# EAGLE board PDNode_Devboard_v0.0.1 (EAGLE 9.2.1), part 1 of 2
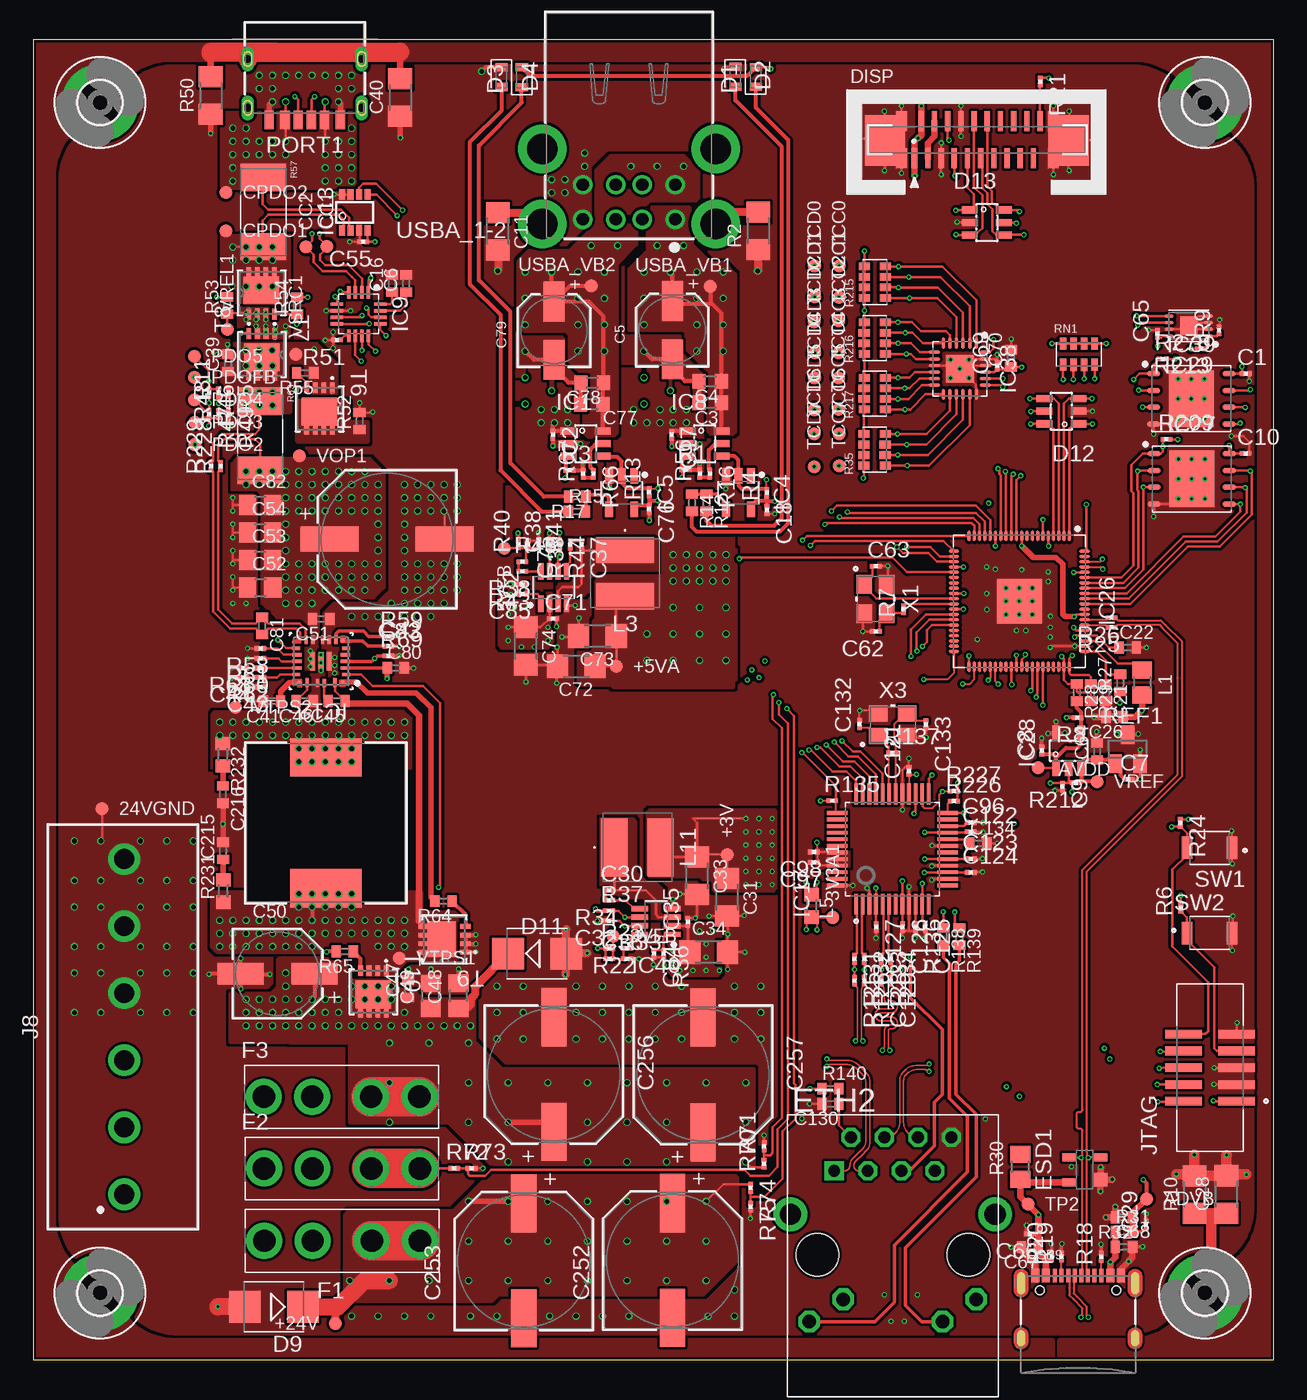
[diagram p7: board, top side]
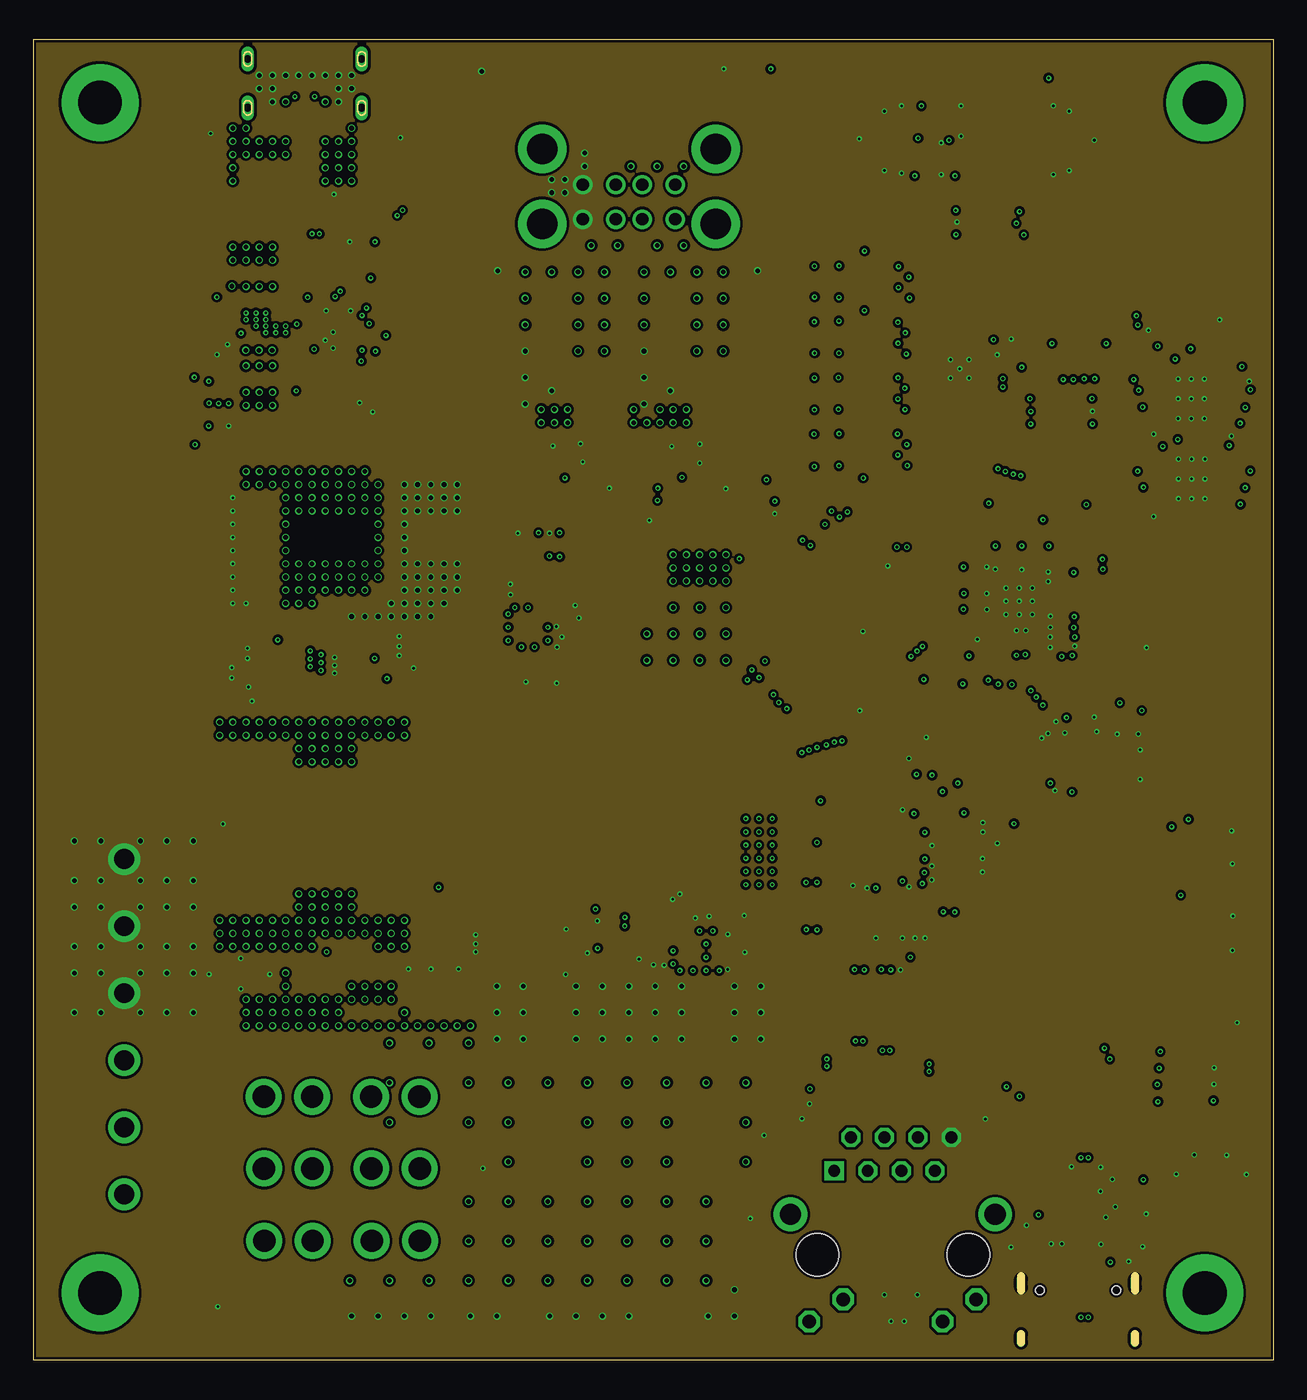
[diagram p8: board, inner layer L2-GND]
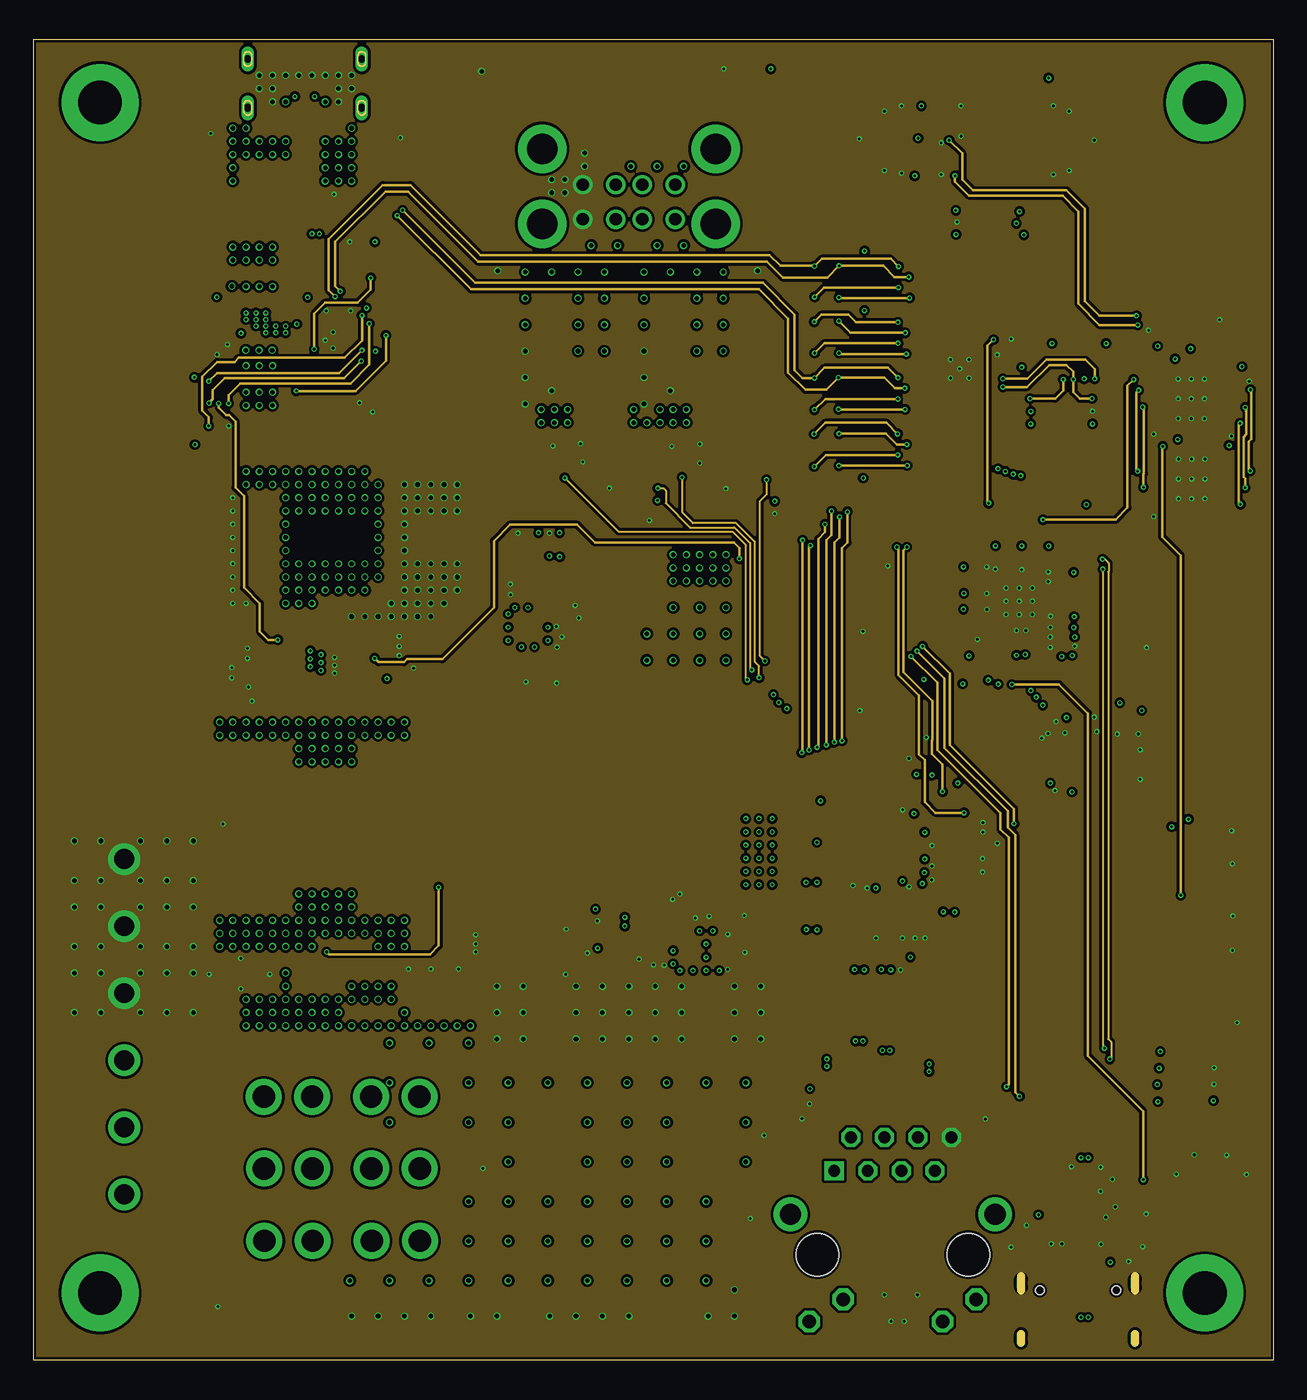
[diagram p9: board, inner layer L3-SIG]
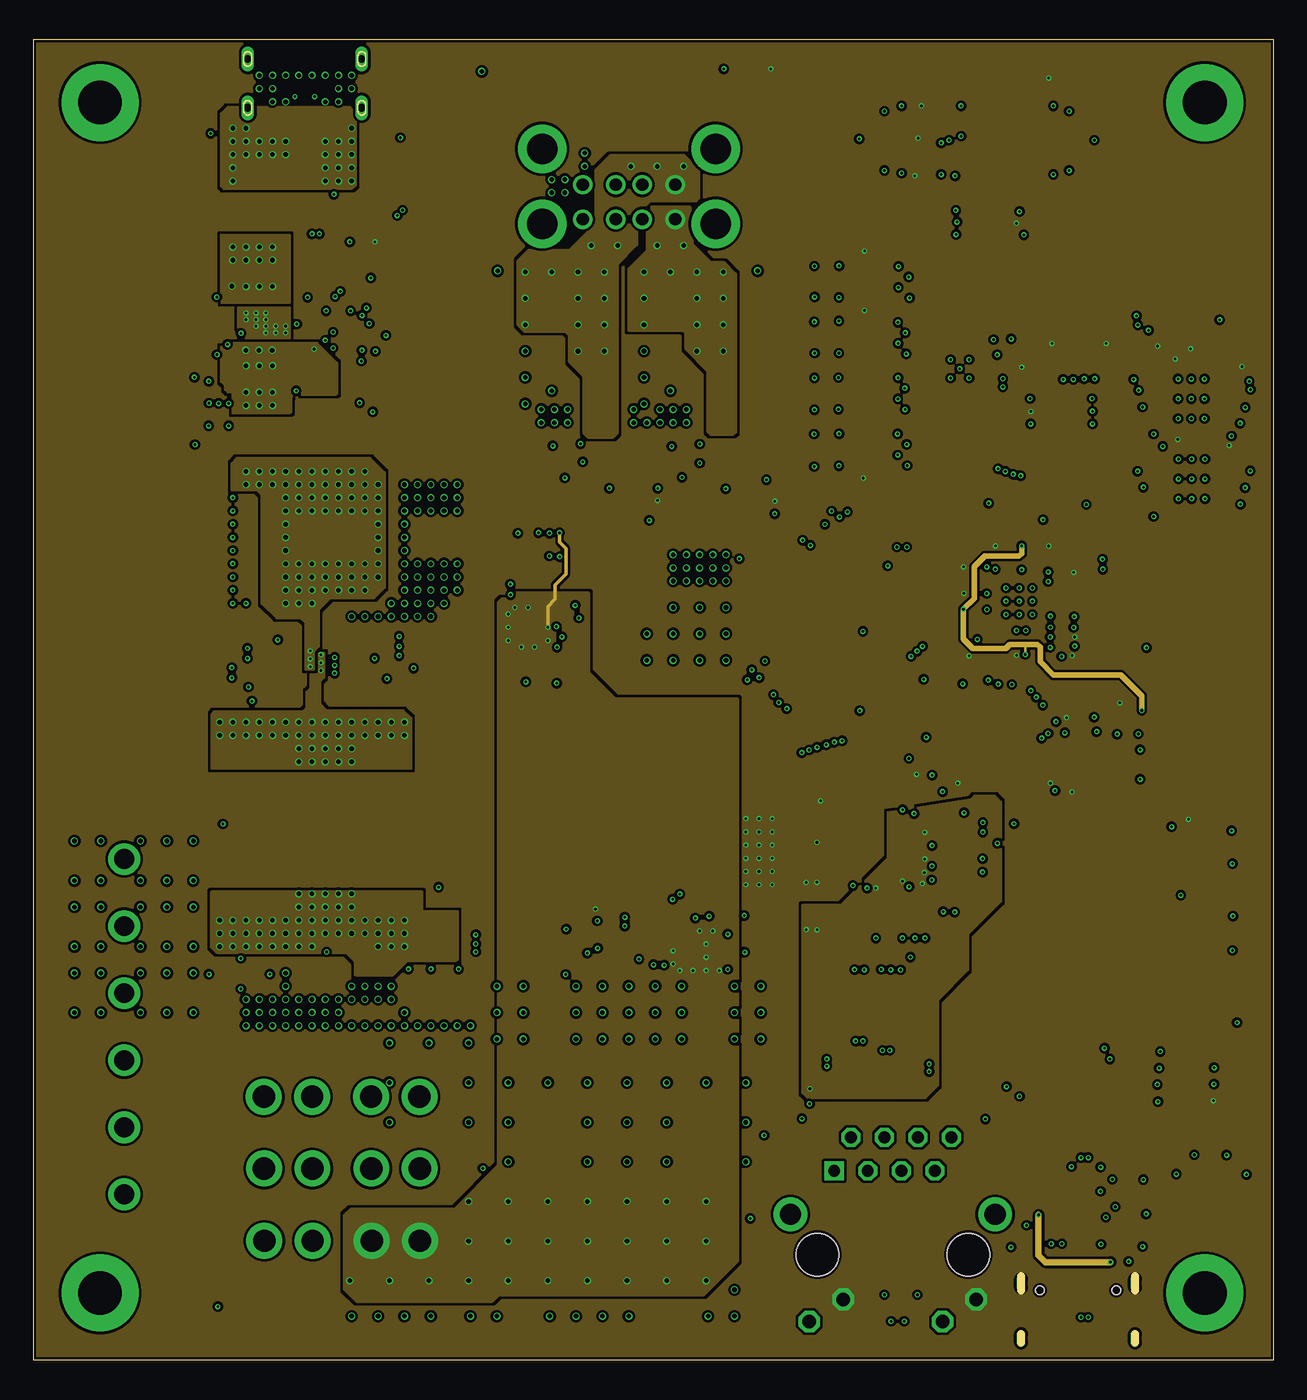
[diagram p10: board, inner layer L4-PWR]
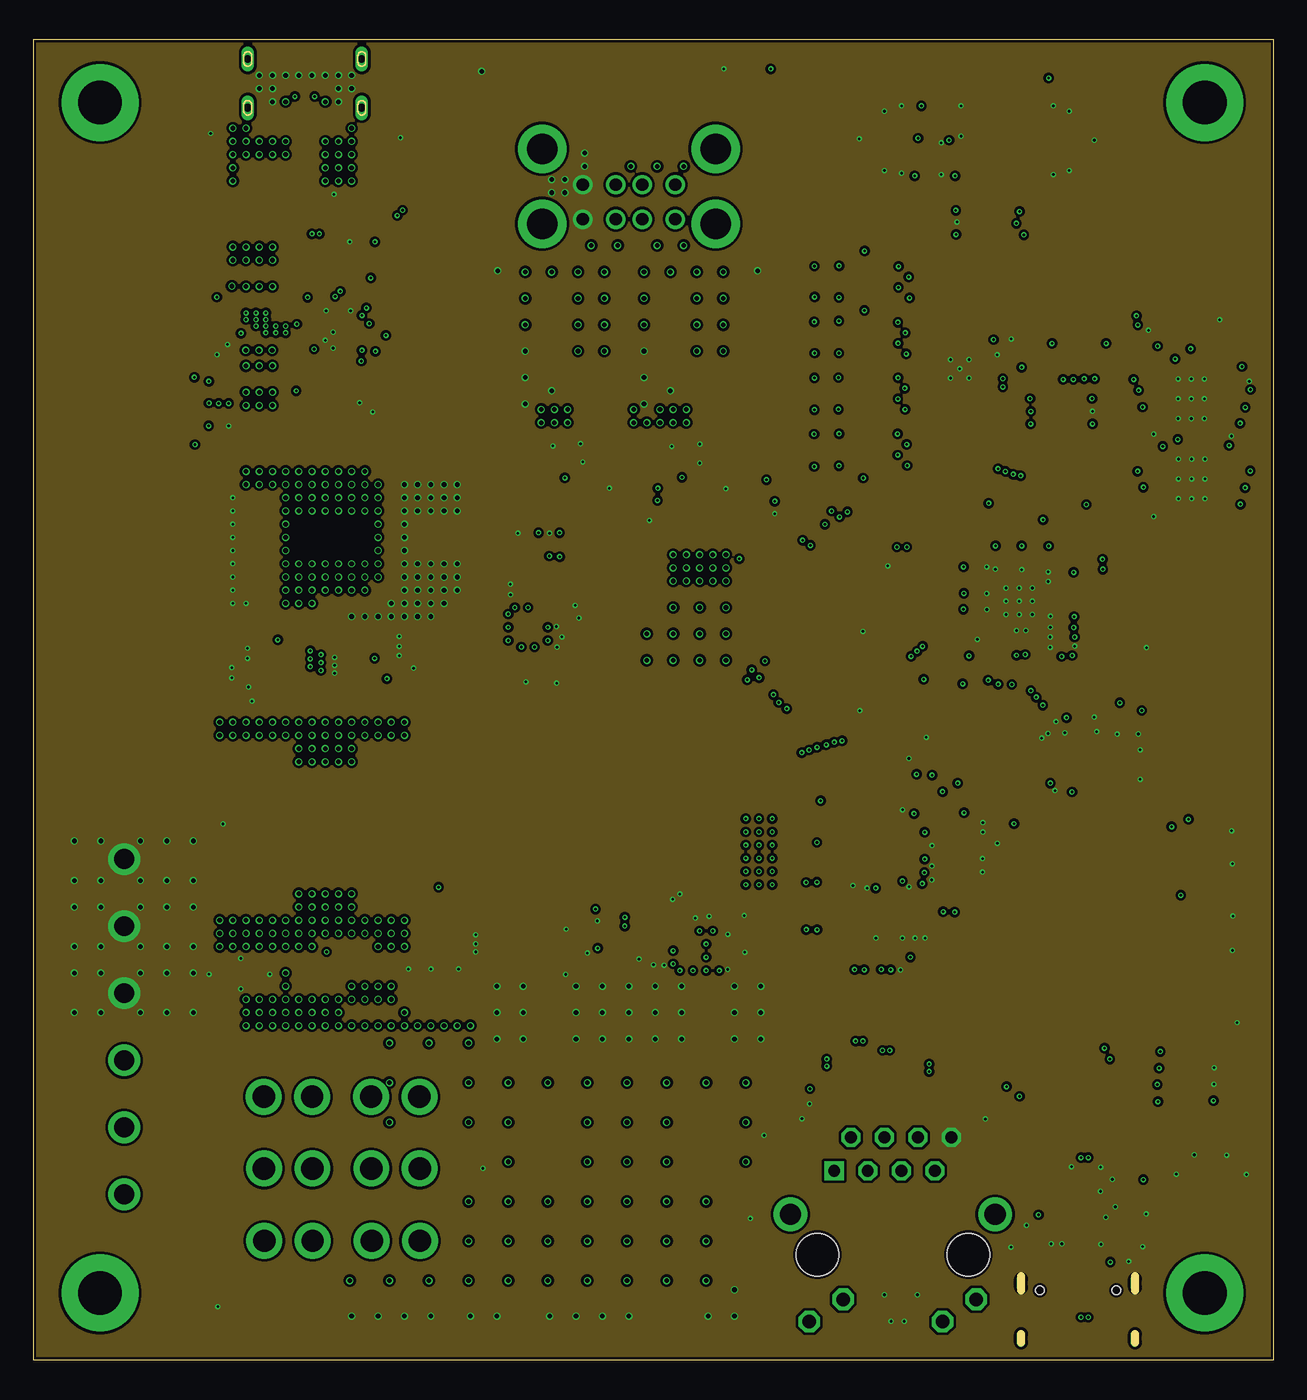
[diagram p11: board, inner layer L5-GND]
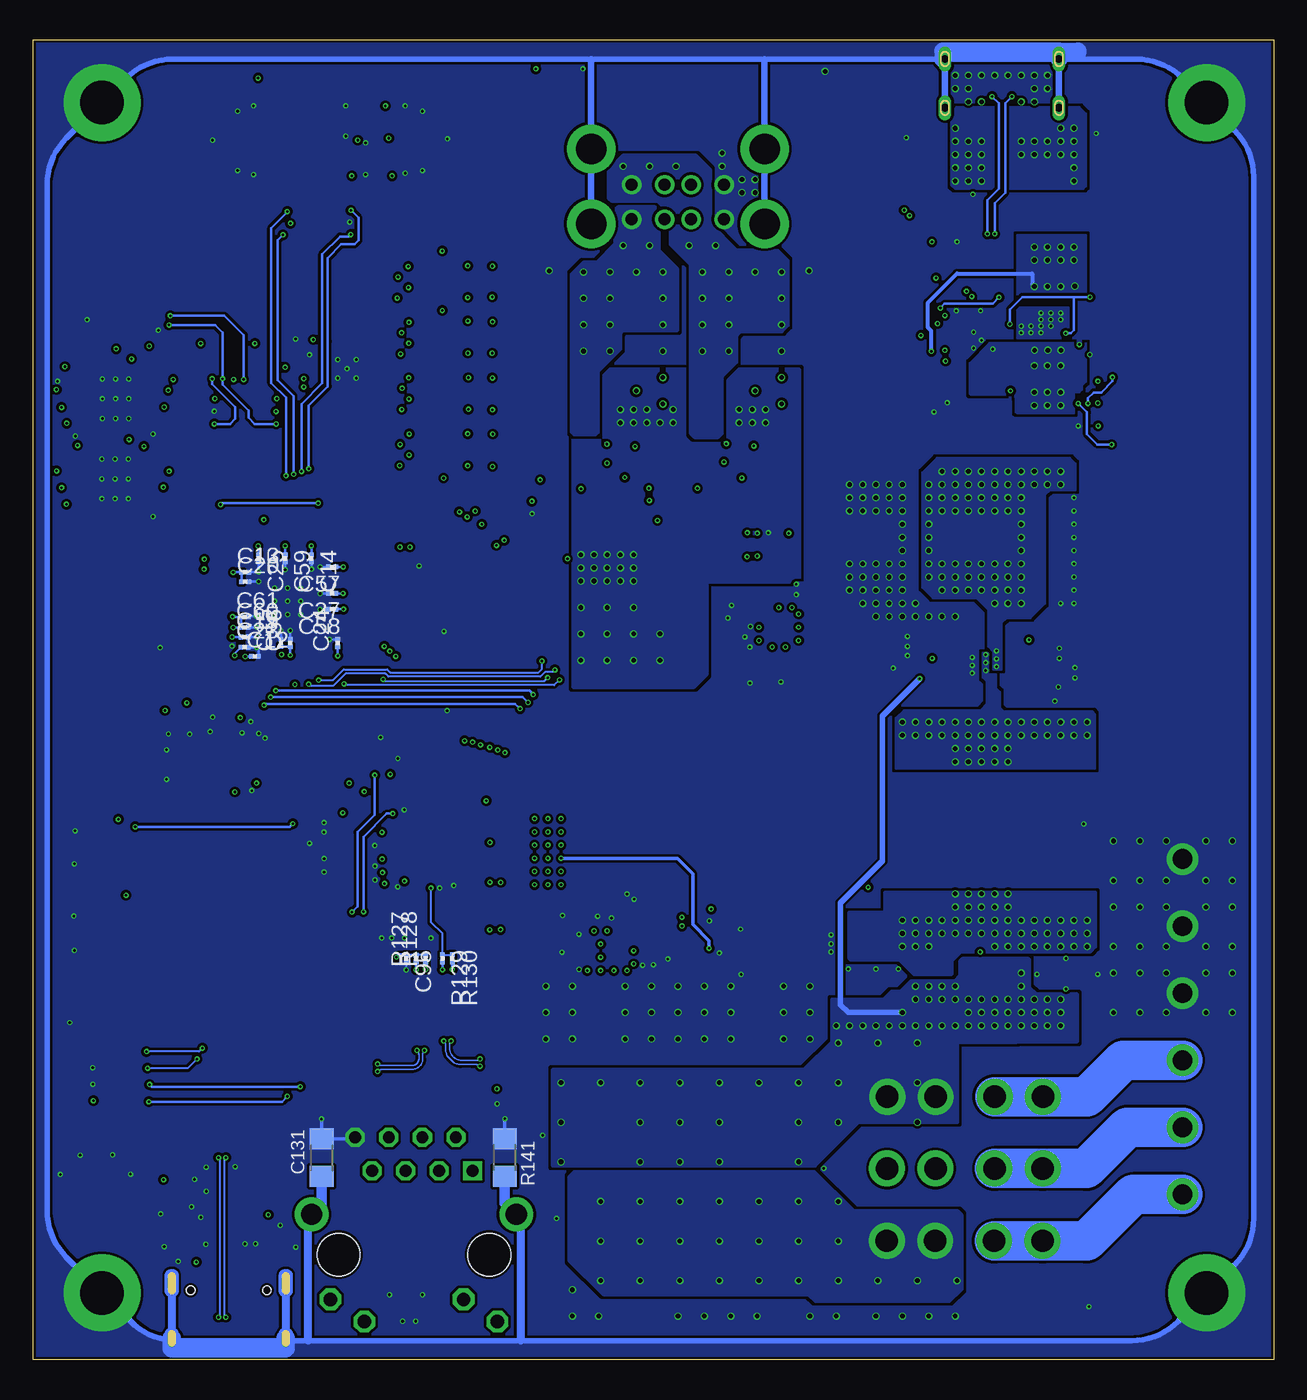
[diagram p12: board, bottom side, seen from below]

Size 94 x 100 mm. Coordinates in mm from the lower left corner, seen from the top.
Outline: 0,0 94,0 94,100 0,100 0,0
Copper layers (1+2*3+14*15+16): L1-HS 0.035mm / dielectric 0.0994mm / L2-GND 0.0152mm / dielectric 0.55mm / L3-SIG 0.0152mm / dielectric 0.1088mm / L4-PWR 0.0152mm / dielectric 0.55mm / L5-GND 0.0152mm / dielectric 0.0994mm / L6-HS 0.035mm
Design rules "JLC06161H-3313_6-layer_50RSE-85RD-90RD-100RD": minimum track width 3.5mil, minimum drill 0.15mm, track to track 3.5mil, track to pad 3.5mil, pad to pad 3.5mil, via to via 3.5mil, smd to smd 3.5mil, copper to edge 0.2mm, drill to drill 6mil, minimum pad ring 3.5mil, minimum via ring 3.5mil, stop-mask expansion 0.05mm, vias tented up to drill 16mil, thermal gap 10mil
Net classes: 0 50R_SE: width 0.149 mm, drill 0.2 mm, clearance 0.178 mm; 1 100R_DIFFPAIR: width 0.115 mm, drill 0.2 mm, clearance 0.178 mm; 2 90R_DIFFPAIR: width 0.149 mm, drill 0.2 mm, clearance 0.178 mm; 3 50R_DIFFPAIR: width 0.203 mm, drill 0.2 mm, clearance 0.178 mm

## Footprints (pad centres in the part's own frame; a part is rotated, then mirrored left to right if it is on the bottom)
TP-ROUND = smd 1 x 1: TP 0,0
0201 = smd 0.34 x 0.35: 1 -0.275,0; 2 0.275,0
0603 = smd 1 x 1.1: 1 -0.85,0; 2 0.85,0
5X5.5(DXL) = smd 3 x 1.6: 1 2.2,0; 2 -2.2,0
0402 = smd 0.7 x 0.9: 1 -0.65,0; 2 0.65,0
1206 = smd 1.6 x 1.803: 1 -1.422,0; 2 1.422,0
0805 = smd 1.3 x 1.5: 1 -0.95,0; 2 0.95,0
6.3X7.7(DXL) = smd 3.5 x 1.6: 1 2.8,0; 2 -2.8,0
10X10.5(DXL) = smd 4.4 x 1.9: 1 4.35,0; 2 -4.35,0
LED-0603 = smd 0.612 x 0.912: A 0.75,0; C -0.75,0
SMB = smd 2.4 x 2.4: A 2.2,0; C -2.2,0
SOT23-6 = smd 0.55 x 1.2: 1 -0.95,-1.3; 2 0,-1.3; 3 0.95,-1.3; 4 0.95,1.3; 5 0,1.3; 6 -0.95,1.3
FPC20 = smd 0.4 x 1.5: 1 -4.552,-1.362; 2 -4.052,1.438; 3 -3.552,-1.362; 4 -3.052,1.438; 5 -2.552,-1.362; 6 -2.052,1.438; 7 -1.552,-1.362; 8 -1.052,1.438; 9 -0.552,-1.362; 10 -0.052,1.438; 11 0.448,-1.362; 12 0.948,1.438; 13 1.448,-1.362; 14 1.948,1.438; 15 2.448,-1.362; 16 2.948,1.438; 17 3.448,-1.362; 18 3.948,1.438; 19 4.448,-1.362; 20 4.948,1.438 | smd 3.048 x 3.81: Z0 -6.795,0; Z5 7.112,0 | smd 0.8 x 1.5: Z1 -5.552,-1.362; Z2 -5.552,1.438; Z3 5.948,-1.362; Z4 5.948,1.438
SOT143 = smd 1 x 1: 1 -0.75,-1.2 | smd 0.6 x 1: 2 0.95,-1.2; 3 0.95,1.2; 4 -0.95,1.2
J1B1211CCD = drill 0.9 square: 1 -4.445,6.35 | drill 0.9 octagon: 2 -3.175,8.89; 3 -1.905,6.35; 4 -0.635,8.89; 5 0.635,6.35; 6 1.905,8.89; 7 3.175,6.35; 8 4.445,8.89 | drill 1.02 octagon: 9 -6.325,-5.08; 10 -3.758,-3.38; 11 3.758,-5.08; 12 6.325,-3.38 | drill 1.6: 13 -7.75,3.05; 14 7.75,3.05 | hole 3.25: -5.715,0; 5.715,0
FUSE_3544-2 = drill 1.7: 1_1 -5.895,0; 1_2 -2.235,0; 2_1 2.235,0; 2_2 5.895,0
3,3-PAD = drill 3.3 pad 5.842: B3,3 0,0
SOT65P280X110-8N = smd 1.259 x 0.4: 1 -1.228,0.975; 2 -1.228,0.325; 3 -1.228,-0.325; 4 -1.228,-0.975; 5 1.228,-0.975; 6 1.228,-0.325; 7 1.228,0.325; 8 1.228,0.975
SOT95P280X145-5N = smd 1.186 x 0.597: 1 -1.264,0.95; 2 -1.264,0; 3 -1.264,-0.95; 4 1.264,-0.95; 5 1.264,0.95
QFN50P300X300X55-16N = smd 0.937 x 0.264: 1 -1.641,0.75; 2 -1.641,0.25; 3 -1.641,-0.25; 4 -1.641,-0.75; 9 1.641,-0.75; 10 1.641,-0.25; 11 1.641,0.25; 12 1.641,0.75 | smd 0.264 x 0.937: 5 -0.75,-1.641; 6 -0.25,-1.641; 7 0.25,-1.641; 8 0.75,-1.641; 13 0.75,1.641; 14 0.25,1.641; 15 -0.25,1.641; 16 -0.75,1.641
RPM0026A-MFG = smd 0.306 x 0.306: 1 -1.661,1.555 | smd 0.6 x 0.25: 2 -1.9,1; 6 -1.9,-1; 14 1.9,-1; 18 1.9,1 | smd 0.725 x 0.25: 3 -1.837,0.5; 4 -1.837,0; 5 -1.837,-0.5; 15 1.837,-0.5; 16 1.837,0; 17 1.837,0.5 | smd 0.29 x 0.29: 7 -1.661,-1.554 | smd 0.25 x 0.625: 8 -1.125,-1.637; 9 -0.625,-1.637; 10 -0.125,-1.637; 11 0.625,-1.637; 12 1.125,-1.637 | smd 0.259 x 0.259: 13 1.644,-1.805 | smd 0.332 x 0.332: 19 1.641,1.591 | smd 0.25 x 0.675: 20 1.05,1.613; 23 -1.05,1.613 | smd 0.25 x 0.6: 21 0.25,1.65; 22 -0.25,1.65 | smd 0.375 x 1.425: 24 -0.625,0; 25 0,0; 26 0.625,0
SOT23-8 = smd 0.45 x 0.8: 1 -0.975,-1.35; 2 -0.325,-1.35; 3 0.325,-1.35; 4 0.975,-1.35; 5 0.975,1.35; 6 0.325,1.35; 7 -0.325,1.35; 8 -0.975,1.35
LQFP48 = smd 1.56 x 0.28: 1 -4.18,2.75; 2 -4.18,2.25; 3 -4.18,1.75; 4 -4.18,1.25; 5 -4.18,0.75; 6 -4.18,0.25; 7 -4.18,-0.25; 8 -4.18,-0.75; 9 -4.18,-1.25; 10 -4.18,-1.75; 11 -4.18,-2.25; 12 -4.18,-2.75; 25 4.18,-2.75; 26 4.18,-2.25; 27 4.18,-1.75; 28 4.18,-1.25; 29 4.18,-0.75; 30 4.18,-0.25; 31 4.18,0.25; 32 4.18,0.75; 33 4.18,1.25; 34 4.18,1.75; 35 4.18,2.25; 36 4.18,2.75 | smd 0.28 x 1.56: 13 -2.75,-4.18; 14 -2.25,-4.18; 15 -1.75,-4.18; 16 -1.25,-4.18; 17 -0.75,-4.18; 18 -0.25,-4.18; 19 0.25,-4.18; 20 0.75,-4.18; 21 1.25,-4.18; 22 1.75,-4.18; 23 2.25,-4.18; 24 2.75,-4.18; 37 2.75,4.18; 38 2.25,4.18; 39 1.75,4.18; 40 1.25,4.18; 41 0.75,4.18; 42 0.25,4.18; 43 -0.25,4.18; 44 -0.75,4.18; 45 -1.25,4.18; 46 -1.75,4.18; 47 -2.25,4.18; 48 -2.75,4.18
QFN80-10X10 = smd 0.811 x 0.22: 1 -4.951,3.8; 2 -4.951,3.4; 3 -4.951,3; 4 -4.951,2.6; 5 -4.951,2.2; 6 -4.951,1.8; 7 -4.951,1.4; 8 -4.951,1; 9 -4.951,0.6; 10 -4.951,0.2; 11 -4.951,-0.2; 12 -4.951,-0.6; 13 -4.951,-1; 14 -4.951,-1.4; 15 -4.951,-1.8; 16 -4.951,-2.2; 17 -4.951,-2.6; 18 -4.951,-3; 19 -4.951,-3.4; 20 -4.951,-3.8; 41 4.951,-3.8; 42 4.951,-3.4; 43 4.951,-3; 44 4.951,-2.6; 45 4.951,-2.2; 46 4.951,-1.8; 47 4.951,-1.4; 48 4.951,-1; 49 4.951,-0.6; 50 4.951,-0.2; 51 4.951,0.2; 52 4.951,0.6; 53 4.951,1; 54 4.951,1.4; 55 4.951,1.8; 56 4.951,2.2; 57 4.951,2.6; 58 4.951,3; 59 4.951,3.4; 60 4.951,3.8 | smd 0.22 x 0.811: 21 -3.8,-4.951; 22 -3.4,-4.951; 23 -3,-4.951; 24 -2.6,-4.951; 25 -2.2,-4.951; 26 -1.8,-4.951; 27 -1.4,-4.951; 28 -1,-4.951; 29 -0.6,-4.951; 30 -0.2,-4.951; 31 0.2,-4.951; 32 0.6,-4.951; 33 1,-4.951; 34 1.4,-4.951; 35 1.8,-4.951; 36 2.2,-4.951; 37 2.6,-4.951; 38 3,-4.951; 39 3.4,-4.951; 40 3.8,-4.951; 61 3.8,4.951; 62 3.4,4.951; 63 3,4.951; 64 2.6,4.951; 65 2.2,4.951; 66 1.8,4.951; 67 1.4,4.951; 68 1,4.951; 69 0.6,4.951; 70 0.2,4.951; 71 -0.2,4.951; 72 -0.6,4.951; 73 -1,4.951; 74 -1.4,4.951; 75 -1.8,4.951; 76 -2.2,4.951; 77 -2.6,4.951; 78 -3,4.951; 79 -3.4,4.951; 80 -3.8,4.951 | smd 3.4 x 3.4: 81 0,0
SON127P600X500X75-8N = smd 1.012 x 0.432: 1 -2.85,1.905; 2 -2.85,0.635; 3 -2.85,-0.635; 4 -2.85,-1.905; 5 2.85,-1.905; 6 2.85,-0.635; 7 2.85,0.635; 8 2.85,1.905 | smd 3.4 x 4.3: PAD 0,0
SOT23-5 = smd 0.55 x 1.2: 1 -0.95,-1.3; 2 0,-1.3; 3 0.95,-1.3; 4 0.95,1.3; 5 -0.95,1.3
SON50P300X200X50-9T130X140N = smd 0.711 x 0.27: 1 -1.501,0.75; 2 -1.501,0.25; 3 -1.501,-0.25; 4 -1.501,-0.75; 5 1.501,-0.75; 6 1.501,-0.25; 7 1.501,0.25; 8 1.501,0.75 | smd 1.3 x 1.4: 9 0,0
QFN50P400X400X100-25T210N = smd 0.86 x 0.264: 1 -1.935,1.25; 2 -1.935,0.75; 3 -1.935,0.25; 4 -1.935,-0.25; 5 -1.935,-0.75; 6 -1.935,-1.25; 13 1.935,-1.25; 14 1.935,-0.75; 15 1.935,-0.25; 16 1.935,0.25; 17 1.935,0.75; 18 1.935,1.25 | smd 0.264 x 0.86: 7 -1.25,-1.935; 8 -0.75,-1.935; 9 -0.25,-1.935; 10 0.25,-1.935; 11 0.75,-1.935; 12 1.25,-1.935; 19 1.25,1.935; 20 0.75,1.935; 21 0.25,1.935; 22 -0.25,1.935; 23 -0.75,1.935; 24 -1.25,1.935 | smd 2.1 x 2.1: 25 0,0
691244510006 = drill 1.5: 1 -12.7,0; 2 -7.62,0; 3 -2.54,0; 4 2.54,0; 5 7.62,0; 6 12.7,0
3220_10_0300_00 = smd 0.65 x 2.77: 1 -2.54,-2.015; 2 -2.54,2.015; 3 -1.27,-2.015; 4 -1.27,2.015; 5 0,-2.015; 6 0,2.015; 7 1.27,-2.015; 8 1.27,2.015; 9 2.54,-2.015; 10 2.54,2.015
WE-PDHV_1280 = smd 2.9 x 5.4: 1 -4.95,0; 2 4.95,0
SRR5228A = smd 4.4 x 2: 1 0,1.75; 2 0,-1.75
632722100213 = smd 0.7 x 1.4: A5 -0.5,2.75; A9 1.5,2.75; A12 2.7,2.75; B5 0.5,2.75; B9 -1.5,2.75; B12 -2.7,2.75 | drill 0.6 pad 0.7 long: S1 -4.32,1.85; S2 4.32,1.85; S3 4.32,-1.85; S4 -4.32,-1.85
R0201 = smd 0.34 x 0.35: 1 -0.275,0; 2 0.275,0
_0603X4-1206 = smd 0.59 x 0.92: A1 -1.2,-0.8; A2 -1.2,0.8; B1 -0.4,-0.8; B2 -0.4,0.8; C1 0.4,-0.8; C2 0.4,0.8; D1 1.2,-0.8; D2 1.2,0.8
2512 = smd 2.08 x 3.44: 1 -2.616,0; 2 2.616,0
SOT23 = smd 1 x 1.4: 1 -0.95,-1.1; 2 0.95,-1.1; 3 0,1.1
B3U-1000P = smd 0.8 x 1.7: 1 -1.7,0; 2 1.7,0
POWERDI3333-8_UX_DIO-L = smd 0.813 x 0.356: 1 -1.6,0.975; 2 -1.6,0.325; 3 -1.6,-0.325; 4 -1.6,-0.975; 5 1.549,-0.975; 6 1.549,-0.325; 7 1.549,0.325; 8 1.549,0.975 | smd 2.1 x 2.69: 9 0.2,0
USB-C = smd 0.3 x 1: A5 -1.18,3.37; A6 -0.18,3.37; A7 0.32,3.37; A8 1.32,3.37; B5 1.82,3.37; B6 0.82,3.37; B7 -0.68,3.37; B8 -1.68,3.37 | smd 0.6 x 1: GND -3.155,3.37; GND2 3.295,3.37; VBUS1 -2.38,3.37; VBUS2 2.52,3.37 | drill 0.4 pad 0.6 long: SHLD1 -4.248,2.795; SHLD2 4.388,2.795; SHLD3 -4.248,-1.385; SHLD4 4.388,-1.385 | hole 0.65: -2.82,2.265; 2.96,2.265
61400826021 = drill 0.92: 1 -3.5,7.11; 2 -1,7.11; 3 1,7.11; 4 3.5,7.11; 5 -3.5,4.49; 6 -1,4.49; 7 1,4.49; 8 3.5,4.49 | drill 2.3: S1 -6.57,7.46; S2 6.57,7.46; S3 -6.57,1.78; S4 6.57,1.78
WE-XTAL_CFPX-180 = smd 1.4 x 1.2: 1 -1.1,-0.85; 2 1.1,-0.85; 3 1.1,0.85; 4 -1.1,0.85

## Placement (x,y rotation side)
3V3A1  DNI  [TP-ROUND]  60.59,33.52 90 top
3VFB  DNI  [TP-ROUND]  43.95,32.11 0 top
5VFB  DNI  [TP-ROUND]  35.72,61.5 270 top
24VGND  DNI  [TP-ROUND]  5.24,41.76 0 top
+3V  DNI  [TP-ROUND]  52.58,38.29 90 top
+5VA  DNI  [TP-ROUND]  44.19,52.53 0 top
+24V  DNI  [TP-ROUND]  22.92,2.76 180 top
ADVB  DNI  [TP-ROUND]  84.37,12.2 0 top
AVDD  DNI  [TP-ROUND]  76.16,44.85 0 top
C1  100nF 25V  [0201]  91.87,74.72 0 top
C2  100nF 25V  [0201]  39.39,70.09 270 top
C3  10uF 16V  [0603]  51.3,72.49 180 top
C4  10uF 16V  [0603]  51.3,74.13 180 top
C5  100uF 16V  [5X5.5(DXL)]  48.44,78.01 90 top
C6  1uF 50V  [0402]  28.27,81.54 90 top
C7  100nF 25V  [0201]  82.99,43.98 0 top
C8  100nF 25V  [0201]  76.43,46.17 90 top
C9  100nF 25V  [0201]  77.99,43.43 270 top
C10  100nF 25V  [0201]  91.86,68.67 0 top
C11  1nF 2kV  [1206]  35.22,85.5 270 top
C12  100nF 25V  [0201]  77.19,53.3 0 bottom
C13  100nF 25V  [0201]  77.92,59.67 0 bottom
C14  100nF 25V  [0201]  72.91,60.72 270 bottom
C15  100nF 25V  [0201]  75.22,54.32 90 bottom
C16  1uF 50V  [0402]  27.19,81.54 90 top
C17  100nF 25V  [0201]  48.38,70.08 270 top
C18  100nF 25V  [0201]  55.6,64.38 270 top
C19  100nF 25V  [0201]  77.97,54.76 0 bottom
C20  100nF 25V  [0201]  77.92,58.95 0 bottom
C21  4.7uF 25V  [0402]  81.26,50.55 270 top
C22  4.7uF 25V  [0402]  82.93,53.96 0 top
C23  100nF 25V  [0201]  77.97,54 0 bottom
C24  100nF 25V  [0201]  70.92,54.3 90 bottom
C25  100nF 25V  [0201]  76.91,60.72 270 bottom
C26  4.7uF 25V  [0402]  81.94,48.71 180 top
C27  100nF 25V  [0201]  71.34,58.07 180 bottom
C28  1nF 2kV  [1206]  90.39,12.54 90 top
C29  100nF 25V  [0201]  84.32,10.24 90 top
C30  100nF 25V  [0201]  43.65,35.58 0 top
C31  22uF 25V  [1206]  52.58,35.05 270 top
C32  100nF 25V  [0201]  43.62,33.26 180 top
C33  22uF 25V  [1206]  50.31,36.68 270 top
C34  22uF 25V  [1206]  51.18,30.89 0 top
C35  100nF 25V  [0201]  49.61,33.17 90 top
C36  33pF 50V  [0201]  43.66,30.39 0 top
C37  100nF 25V  [0201]  41.56,61.77 270 top
C38  100nF 25V  [0201]  39.12,61.78 90 top
C39  1uF 50V  [0402]  14.77,75.52 90 top
C40  1nF 2kV  [1206]  27.82,95.64 90 top
C41  4.7uF 25V  [0402]  18.11,49.9 180 top
C42  10nF 50V  [0201]  26.92,54.07 0 top
C43  100pF 50V  [0201]  17.23,50.98 180 top
C44  10nF 50V  [0201]  15.93,51.7 180 top
C45  100nF 50V  [0402]  23,49.91 180 top
C46  100nF 50V  [0402]  20.59,49.91 180 top
C47  1uF 50V  [0402]  28.43,28.12 90 top
C48  10uF 50V  [0805]  32.25,27.59 90 top
C49  10uF 50V  [0805]  30.14,27.58 90 top
C50  100uF 50V  [6.3X7.7(DXL)]  18.53,29.26 0 top
C51  1uF 50V  [0402]  21.84,56.13 180 top
C52  10uF 50V  [0805]  17.22,58.51 0 top
C53  10uF 50V  [0805]  17.21,60.6 0 top
C54  10uF 50V  [0805]  17.21,62.67 0 top
C55  100nF 25V  [0201]  25.01,84.7 180 top
C56  100nF 25V  [0201]  74.51,54.31 90 bottom
C57  100nF 25V  [0201]  71.34,60.08 180 bottom
C58  100nF 25V  [0201]  71.34,56.87 180 bottom
C59  100nF 25V  [0201]  74.9,60.72 270 bottom
C60  100nF 25V  [0201]  77.97,55.49 0 bottom
C61  100nF 25V  [0201]  77.97,56.29 0 bottom
C62  15pF 50V  [0201]  63.85,55.19 180 top
C63  15pF 50V  [0201]  63.85,60.13 0 top
C64  4.7uF 25V  [0402]  80.61,46.09 90 top
C65  100nF 25V  [0201]  85.19,77.73 90 top
C66  100nF 25V  [0201]  75.52,9.53 180 top
C67  4.7uF 25V  [0402]  75.52,8.55 180 top
C68  4.7uF 25V  [0402]  82.65,8.56 0 top
C69  100nF 25V  [0201]  73.05,75.31 90 top
C70  4.7uF 25V  [0402]  74.08,75.87 90 top
C71  100nF 25V  [0201]  39.39,56.15 0 top
C72  22uF 25V  [1206]  41.15,52.55 180 top
C73  22uF 25V  [1206]  42.76,54.84 180 top
C74  22uF 25V  [1206]  37.34,54.08 270 top
C75  33pF 50V  [0201]  37.52,61.77 270 top
C76  100nF 25V  [0201]  46.68,64.45 270 top
C77  10uF 16V  [0603]  42.34,72.39 180 top
C78  10uF 16V  [0603]  42.37,74.03 180 top
C79  100uF 16V  [5X5.5(DXL)]  39.47,77.97 90 top
C80  1uF 50V  [0402]  27.49,52.43 0 top
C81  100nF 50V  [0402]  17.35,55.61 270 top
C82  10uF 50V  [0805]  17.21,64.75 0 top
C83  330uF 50V  [10X10.5(DXL)]  26.83,62.17 180 top
C84  1nF 25V  [0201]  47.04,30.78 270 top
C85  1nF 25V  [0201]  37.08,58.02 180 top
C95  100nF 25V  [0201]  65.72,30.4 270 bottom
C96  100nF 25V  [0201]  71.04,40.71 0 top
C97  100nF 25V  [0201]  59.15,37.7 180 top
C98  100nF 25V  [0201]  59.15,38.48 180 top
C121  100nF 25V  [0201]  66.36,44.63 90 top
C122  100nF 25V  [0201]  71.04,40 0 top
C123  100nF 25V  [0201]  71.05,37.96 0 top
C124  100nF 25V  [0201]  71.05,36.93 0 top
C125  100nF 25V  [0201]  67.58,32.79 270 top
C126  100nF 25V  [0201]  65.88,32.79 270 top
C127  100nF 25V  [0201]  63.88,32.79 270 top
C128  6.8nF 50V  [0201]  64.26,28.73 270 top
C129  6.8nF 50V  [0201]  64.98,28.73 270 top
C130  22nF 50V  [0402]  60.41,19.41 180 top
C131  1nF 2kV  [1206]  72.14,15.32 90 bottom
C132  18pF 50V  [0201]  62.62,48.17 90 top
C133  18pF 50V  [0201]  67.64,48.13 270 top
C134  4.7uF 25V  [0402]  71.62,39.13 0 top
C215  2.2nF 50V  [0402]  14.4,38.56 90 top
C216  2.2nF 50V  [0402]  14.39,42.82 270 top
C252  330uF 50V  [10X10.5(DXL)]  48.45,7.53 90 top
C253  330uF 50V  [10X10.5(DXL)]  37.18,7.5 90 top
C256  330uF 50V  [10X10.5(DXL)]  39.46,21.62 270 top
C257  330uF 50V  [10X10.5(DXL)]  50.76,21.59 270 top
CC1  DNI  [TP-ROUND]  22.28,84.36 90 top
CC2  DNI  [TP-ROUND]  20.68,84.31 90 top
CPDO1  DNI  [TP-ROUND]  14.6,85.54 0 top
CPDO2  DNI  [TP-ROUND]  14.61,88.44 0 top
D1  Green  [LED-0603]  54.76,97.19 90 top
D2  Red  [LED-0603]  53.21,97.2 270 top
D3  Green  [LED-0603]  37.03,97.17 90 top
D4  Red  [LED-0603]  35.49,97.18 270 top
D9  SMBJ33A  [SMB]  18.25,4.02 180 top
D11  SMBJ33A  [SMB]  38.19,30.78 0 top
D12  [SOT23-6]  77.91,71.87 90 top
D13  [SOT23-6]  72.26,86.16 270 top
DISP  AFC11-S20ICC-00  [FPC20]  71.34,92.39 0 top
ESD1  SP0503BAHTG  [SOT143]  79.67,14.41 90 top
ETH2  J1B1211CCD  [J1B1211CCD]  65.14,7.97 0 top
F1  2A  [FUSE_3544-2]  23.42,9.02 0 top
F2  DNI  [FUSE_3544-2]  23.4,14.5 0 top
F3  15A  [FUSE_3544-2]  23.38,19.93 0 top
H1  MOUNT-PAD-ROUND3.3  [3,3-PAD]  88.77,5.08 0 top
H2  MOUNT-PAD-ROUND3.3  [3,3-PAD]  5.08,5.08 0 top
H3  MOUNT-PAD-ROUND3.3  [3,3-PAD]  5.08,95.25 0 top
H4  MOUNT-PAD-ROUND3.3  [3,3-PAD]  88.77,95.25 0 top
IC1  AP22653W6  [SOT23-6]  41.87,69.41 270 top
IC2  MP2315GJ-Z  [SOT65P280X110-8N]  39.45,58.51 90 top
IC4  SN74LVC1G04DBVR  [SOT95P280X145-5N]  53.44,65.7 270 top
IC5  SN74LVC1G04DBVR  [SOT95P280X145-5N]  44.6,65.7 270 top
IC8  AP22653W6  [SOT23-6]  50.88,69.41 270 top
IC9  STUSB4710AQ1TR  [QFN50P300X300X55-16N]  24.67,79.23 270 top
IC12  TPS552882  [RPM0026A-MFG]  21.82,52.92 180 top
IC13  INA219BIDCNT  [SOT23-8]  24.38,86.93 0 top
IC17  W5500  [LQFP48]  65.11,38.69 90 top
IC26  RP2354B  [QFN80-10X10]  74.71,57.47 270 top
IC27  W25Q128JVPIQ  [SON127P600X500X75-8N]  87.78,66.74 0 top
IC28  MCP6001RT-I/OT  [SOT23-5]  78.46,46.15 0 top
IC29  CAT24C256HU4IGT3  [SON50P300X200X50-9T130X140N]  87.56,78.32 180 top
IC38  TCA9548ARGER  [QFN50P400X400X100-25T210N]  70.21,75.08 270 top
IC39  W25Q128JVPIQ  [SON127P600X500X75-8N]  87.75,72.81 0 top
IC40  MP2315GJ-Z  [SOT65P280X110-8N]  47.2,33.21 180 top
J8  691244510006  [691244510006]  6.91,25.24 90 top
JTAG  [3220_10_0300_00]  89.17,22.14 90 top
L1  3.3uH  [0805]  84.02,51.32 270 top
L2  4.7uH 11.3A  [WE-PDHV_1280]  22.19,40.68 90 top
L3  4.7uH 3.5A  [SRR5228A]  44.85,59.6 0 top
L5  BLM18EG221TN1D  [0603]  58.99,34.39 270 top
L11  4.7uH 3.5A  [SRR5228A]  45.79,38.83 90 top
PDO2  DNI  [TP-ROUND]  12.28,69.34 0 top
PDO3  DNI  [TP-ROUND]  12.26,71.04 0 top
PDO4  DNI  [TP-ROUND]  12.24,72.74 0 top
PDO5  DNI  [TP-ROUND]  12.22,76.04 0 top
PDOFB  DNI  [TP-ROUND]  12.22,74.44 0 top
PORT1  632722100213  [632722100213]  20.59,96.7 180 top
R1  10K 1%  [0201]  49.44,67.43 0 top
R2  1M 1%  [1206]  54.94,85.53 90 top
R3  10K 1%  [0201]  40.64,67.4 0 top
R4  10K 1%  [0201]  55.59,65.69 90 top
R5  200K 1%  [0201]  14.81,73.27 270 top
R6  1K 1%  [0201]  86.95,34.25 90 top
R7  1K 1%  [0201]  65.95,56.87 90 top
R8  DNI  [R0201]  79.13,48.66 180 top
R9  4.7K 1%  [0201]  89.85,78 90 top
R10  1M 1%  [1206]  87.99,12.53 90 top
R11  12.7K 1%  [0201]  14.07,73.27 90 top
R12  1K 1%  [0402]  51.02,64.94 270 top
R13  10K 1%  [0201]  46.68,65.75 90 top
R14  1K 1%  [0402]  49.92,64.94 270 top
R15  1K 1%  [0402]  41.21,64.27 0 top
R16  10K 1%  [0201]  51.27,67.14 270 top
R17  1K 1%  [0402]  41.22,65.39 180 top
R18  5.1K 1%  [0201]  80.92,7.81 90 top
R19  5.1K 1%  [0201]  77.91,7.82 90 top
R20  2.2K 1%  [0201]  77.18,7.82 90 top
R21  10K 1%  [0201]  76.31,96.84 270 top
R22  33K 1%  [0201]  44.99,31.18 180 top
R23  40.2K 1%  [0201]  43.65,31.17 0 top
R24  10K 1%  [0201]  86.92,40.68 270 top
R25  27R 1%  [0201]  81.71,55.51 180 top
R26  27R 1%  [0201]  81.71,56.22 180 top
R27  33R 1%  [0402]  82.36,51.29 90 top
R28  0R 1%  [0402]  79.07,50.55 270 top
R29  0R 1%  [0402]  80.15,50.55 270 top
R30  0R 1%  [0805]  74.8,14.62 90 top
R31  10K 1%  [0402]  82.66,9.69 0 top
R32  10K 1%  [0402]  82.65,10.8 180 top
R33  12.7K 1%  [0201]  45,30.39 0 top
R34  10R 1%  [0201]  43.64,34.82 180 top
R35  3.3K 1%  [_0603X4-1206]  63.76,68.95 90 top
R36  75K 1%  [0201]  47.78,30.78 270 top
R37  100K 1%  [0201]  43.63,34.03 0 top
R38  10K 1%  [0201]  37.07,59.74 180 top
R39  40.2K 1%  [0201]  38.31,61.78 270 top
R40  7.5K 1%  [0201]  36.77,61.78 90 top
R41  10R 1%  [0201]  40.7,61.77 90 top
R43  75K 1%  [0201]  37.07,58.75 180 top
R44  100K 1%  [0201]  39.9,61.78 270 top
R45  10K 1%  [0201]  37.07,60.47 0 top
R46  4.64K 1%  [0201]  13.33,73.28 270 top
R47  4.64K 1%  [0201]  13.33,71.65 270 top
R48  8.87K 1%  [0201]  14.07,71.64 90 top
R49  30.9K 1%  [0201]  14.81,71.64 270 top
R50  1M 1%  [1206]  13.47,95.78 90 top
R51  100K 1%  [0201]  23.02,77.26 180 top
R52  10K 1%  [0402]  24.75,71.12 90 top
R53  10K 1%  [0402]  14.72,79.87 90 top
R54  10K 1%  [0402]  20,79.86 90 top
R55  10K 1%  [0402]  20.62,74.77 180 top
R56  10K 1%  [0201]  50.52,67.15 90 top
R57  0.010R 1%  [2512]  17.45,86.95 270 top
R58  0R 1%  [0201]  17.23,53.89 180 top
R59  49.9K 1%  [0201]  26.92,54.81 0 top
R60  10K 1%  [0201]  17.23,52.41 180 top
R61  150K  [R0201]  17.23,53.15 180 top
R62  15K 1%  [0201]  17.23,51.7 180 top
R63  0.010R 1%  [2512]  17.21,69.99 270 top
R64  1R 1%  [0402]  31.09,34.75 180 top
R65  1R 1%  [0402]  23.62,30.94 180 top
R66  10K 1%  [0201]  42.45,67.13 270 top
R67  10K 1%  [0201]  41.68,67.13 90 top
R68  10K 1%  [0201]  15.93,52.41 180 top
R69  10K 1%  [0201]  26.92,53.33 0 top
R70  100K 1%  [0201]  55.38,14.87 90 top
R71  10K 1%  [0201]  55.39,16.18 90 top
R72  100K 1%  [0201]  31.91,14.51 0 top
R73  10K 1%  [0201]  33.22,14.51 0 top
R74  100K 1%  [0201]  54.37,13.04 270 top
R75  10K 1%  [0201]  54.37,11.61 270 top
R125  0R 1%  [0201]  62.24,28.73 270 top
R126  0R 1%  [0201]  62.98,28.73 270 top
R127  49.9R 1%  [0201]  64.98,30.4 90 bottom
R128  49.9R 1%  [0201]  64.26,30.4 90 bottom
R129  49.9R 1%  [0201]  62.98,30.41 270 bottom
R130  49.9R 1%  [0201]  62.24,30.41 270 bottom
R131  3.3R 1%  [0201]  62.24,30.38 270 top
R132  3.3R 1%  [0201]  62.98,30.38 270 top
R133  3.3R 1%  [0201]  64.26,30.37 270 top
R134  3.3R 1%  [0201]  64.98,30.37 270 top
R135  4.7K 1%  [0201]  60.55,42.36 0 top
R136  12.4K 1%  [0201]  66.86,32.79 270 top
R137  1M 1%  [0201]  65.11,45.98 0 top
R138  470R 1%  [0402]  68.98,32.07 270 top
R139  470R 1%  [0402]  70.17,32.07 270 top
R140  470R 1%  [0402]  60.41,20.55 0 top
R141  1M 1%  [1206]  58.26,15.33 270 bottom
R209  DNI  [R0201]  85.87,69.75 0 top
R212  4.7K 1%  [0201]  79,43.72 180 top
R213  NC  [R0201]  88.49,76.6 180 top
R215  3.3K 1%  [_0603X4-1206]  63.79,81.64 90 top
R216  3.3K 1%  [_0603X4-1206]  63.77,77.41 90 top
R217  3.3K 1%  [_0603X4-1206]  63.77,73.2 90 top
R226  4.7K 1%  [0201]  69.77,42.33 0 top
R227  4.7K 1%  [0201]  69.77,43.09 0 top
R228  0R 1%  [0201]  14.2,67.71 90 top
R229  0R 1%  [0201]  13.49,67.71 90 top
R231  1R 1%  [0603]  14.41,35.52 90 top
R232  1R 1%  [0603]  14.39,45.85 270 top
R278  DNI  [R0201]  85.6,75.83 0 top
REF1  LM4040x30  [SOT23]  82.92,46.27 0 top
RN1  3.3K 1%  [_0603X4-1206]  79.23,76.18 0 top
SW1  B3U-1000P  [B3U-1000P]  89.13,38.79 180 top
SW2  B3U-1000P  [B3U-1000P]  89.12,32.34 0 top
T6  DMP3013SFV  [POWERDI3333-8_UX_DIO-L]  21.71,72.04 270 top
T7  DMP3013SFV  [POWERDI3333-8_UX_DIO-L]  17.34,76.15 270 top
T8  DMP3013SFV  [POWERDI3333-8_UX_DIO-L]  17.32,80.83 90 top
T9  BSZ065N06  [POWERDI3333-8_UX_DIO-L]  31.16,31.86 180 top
T10  BSZ065N06  [POWERDI3333-8_UX_DIO-L]  25.79,27.89 270 top
TCC0  DNI  [TP-ROUND]  61.07,82.88 90 top
TCC1  DNI  [TP-ROUND]  61.06,80.49 90 top
TCC2  DNI  [TP-ROUND]  61.05,78.7 90 top
TCC3  DNI  [TP-ROUND]  61.05,76.27 90 top
TCC4  DNI  [TP-ROUND]  61.02,74.41 90 top
TCC5  DNI  [TP-ROUND]  61.02,72.01 90 top
TCC6  DNI  [TP-ROUND]  61.07,70.16 90 top
TCC7  DNI  [TP-ROUND]  61.06,67.74 90 top
TCD0  DNI  [TP-ROUND]  59.2,82.86 90 top
TCD1  DNI  [TP-ROUND]  59.21,80.52 90 top
TCD2  DNI  [TP-ROUND]  59.19,78.64 90 top
TCD3  DNI  [TP-ROUND]  59.21,76.27 90 top
TCD4  DNI  [TP-ROUND]  59.2,74.39 90 top
TCD5  DNI  [TP-ROUND]  59.2,71.98 90 top
TCD6  DNI  [TP-ROUND]  59.17,70.14 90 top
TCD7  DNI  [TP-ROUND]  59.19,67.67 90 top
TP2  DNI  [TP-ROUND]  75.37,11.79 0 top
USB9  USB-TYPE-C-018  [USB-C]  79.1,3.02 0 top
USBA_1-2  61400826021  [61400826021]  45.15,93.52 180 top
USBA_VB1  DNI  [TP-ROUND]  51.32,81.32 0 top
USBA_VB2  DNI  [TP-ROUND]  42.31,81.36 180 top
VOP1  DNI  [TP-ROUND]  20.19,68.48 0 top
VREF  DNI  [TP-ROUND]  80.61,43.81 0 top
VREL1  DNI  [TP-ROUND]  14.71,78.05 90 top
VSRC1  DNI  [TP-ROUND]  19.91,76.17 90 top
VTPS1  DNI  [TP-ROUND]  27.76,30.44 0 top
VTPS2  DNI  [TP-ROUND]  15.34,49.44 0 top
X1  12MHz  [WE-XTAL_CFPX-180]  63.82,57.64 270 top
X3  25MHz  [WE-XTAL_CFPX-180]  65.14,48.12 0 top

## Tracks (layer width: path | path; a pad name or v marks a point on that pad's centre or on a via)
3V3_EN_SYS1  (via drill 0.2)
  L1-HS 0.203: IC40.6 v44.84,33.53 44.34,34.03 R37.2
3V3_EN_SYS2  (via drill 0.2)
  L1-HS 0.203: IC2.6 39.77,60.73 v39.9,60.85 R44.2
24VINA
  L6-HS 3: J8.3 11.4,22.7 14.17,19.93 F3.1_1 F3.1_2
24VINC
  L6-HS 3: J8.1 10.66,12.54 14.18,9.02 F1.1_1 F1.1_2
!ACT  (via drill 0.2)
  L1-HS 0.203: IC17.27 66.86,41.5 v66.75,41.39 | R138.1 68.98,33.93 v68.96,33.95
  L6-HS 0.203: v68.96,33.95 68.96,39.63 67.2,41.39 v66.75,41.39
!DUP  (via drill 0.2)
  L1-HS 0.149: IC17.26 67.36,41.95 67.51,41.8 68.15,41.8 68.66,42.31 68.66,42.8 v68.91,43.05 68.95,43.09 R227.1
  L1-HS 0.2: v66.2,61.58 67.99,61.58 68.7,60.87 IC26.22
  L3-SIG 0.2: v68.91,43.05 68.91,45.09 68.1,45.9 68.1,46.93 68.14,46.97 68.14,49.92 65.95,52.11 65.95,61.33 v66.2,61.58
!LINK  (via drill 0.2)
  L1-HS 0.203: IC17.25 67.86,44.05 v68.11,44.3 | v69.83,33.93 69.83,33.06 R139.1
  L6-HS 0.203: v68.11,44.3 68.11,41.3 69.42,39.99 69.42,34.34 v69.83,33.93
!QSPI_SS  (via drill 0.2)
  L1-HS 0.2: IC26.75 82.45,59.27 83.36,60.18 83.36,65.67 83.22,65.81 83.22,67.79 84.08,68.64 IC27.1 85.44,68.64 85.59,68.8 v85.59,69.2 R209.1
  L1-HS 0.203: R6.2 v86.95,35.2
  L3-SIG 0.203: v86.95,35.2 86.95,60.94 85.54,62.35 85.54,69.14 v85.59,69.2
!SPD  (via drill 0.2)
  L1-HS 0.149: R226.1 69.29,42.12 IC17.24
  L1-HS 0.2: IC26.23 68.46,60.47 67.82,61.11 66.39,61.11 65.92,61.11 v65.45,61.58
  L1-HS 0.203: IC17.24 v70.53,41.44
  L3-SIG 0.2: v65.45,61.58 65.57,61.45 65.57,51.9 67.13,50.34 67.13,45.86 67.56,45.43 67.56,42.25 68.37,41.44 v70.53,41.44
!TCA_RST  (via drill 0.2)
  L1-HS 0.2: v79.8,64.8 79.8,61.41 IC26.80
  L1-HS 0.203: v72.77,77.29 72.77,76.61 72.48,76.33 IC38.24
  L3-SIG 0.2: v72.77,77.29 72.3,76.82 72.3,65 v72.4,64.9
  L6-HS 0.2: v72.4,64.9 79.7,64.9 v79.8,64.8
!W5500_CS  (via drill 0.2)
  L1-HS 0.2: IC17.32 64.36,44.44 62.7,46.1 62.1,46.1 v61.3,46.9 | IC26.17 72.11,63.49 71.44,64.16 61.79,64.16 v61.7,64.25
  L3-SIG 0.2: v61.3,46.9 61.3,61.5 61.7,61.9 v61.7,64.25
!W5500_INT  (via drill 0.2)
  L1-HS 0.2: IC17.36 62.36,43.84 61.62,44.58 60.56,44.58 58.94,46.2 v58.8,46.2 | IC26.21 68.99,62.04 59.24,62.04 v58.9,61.7
  L3-SIG 0.2: v58.8,46.2 58.8,61.6 v58.9,61.7
!W5500_RST  (via drill 0.2)
  L1-HS 0.149: IC17.37 60.83,41.55 R135.2
  L1-HS 0.2: R135.2 60.83,43.48 58.3,46 v58.24,46 | IC26.20 58.62,62.42 v58.3,62.1
  L3-SIG 0.2: v58.3,62.1 58.3,46.06 v58.24,46
+1V1  (via drill 0.2)
  L1-HS 0.2: IC26.65 79.05,55.27 v78.84,55.48 | IC26.69 IC26.68 79.05,56.47 v78.88,56.3 | IC26.10 v74.91,61.68 v74.9,61.67 | IC26.32 v70.48,56.87 | IC26.51 74.91,53.07 75.17,53.33 v75.17,53.44
  L1-HS 0.406: 83.68,48.92 83.72,48.92 v84,49.2 | v74.9,61.67 75.77,60.8 77.5,60.8 78,60.3 78,56.5 78.2,56.3 v78.88,56.3
  L1-HS 0.508: C26.1 83.47,48.71 83.68,48.92 84.02,49.26 L1.2
  L4-PWR 0.2: v75.17,53.44 75.17,54.18 75.19,54.2
  L4-PWR 0.406: v74.9,61.67 74.9,61.1 74.7,60.9 72.1,60.9 71.3,60.1 71.3,57.69 v70.48,56.87 70.48,54.62 71.2,53.9 73.7,53.9 74,54.2 75.19,54.2 76.1,54.2 76.3,54 76.3,52.9 77.3,51.9 82.4,51.9 84,50.3 v84,49.2
  L6-HS 0.2: C58.1 v70.48,56.87 | C59.1 v74.9,61.67 | v78.88,56.3 v78.87,56.29 C61.1 C60.1 v78.83,55.49 v78.84,55.48
+3V3  (via drill 0.2)
  L1-HS 0.149: v58.57,36.17 58.57,35.66 L5.1 59.39,35.64 v59.39,36.18 | R135.1 v59.66,42.35 | C97.1 C98.1 59.42,39.16 v59.39,39.2 | IC17.28 C121.1 v66.92,44.35 v66.93,44.36
  L1-HS 0.2: v78.92,54.76 79.03,54.87 IC26.64 80.61,54.87 81.52,53.96 C22.1 | v78.72,53.36 78.51,53.15 IC26.60 78.51,52.03 78.64,51.9 79.97,51.9 80.15,51.72 R29.1 | IC26.76 v78.84,59.66 | IC26.5 76.91,61.68 v76.94,61.65 | IC26.15 v72.91,61.67 v72.92,61.66 | IC26.24 v70.5,60.07 | IC26.29 v70.52,58.07 | IC26.41 v70.91,53.34 | IC26.50 v74.51,53.38 | D12.5 75.61,71.87 v75.59,71.85 | IC39.8 C1.1 v91.59,75.25 | R278.2 v86.53,75.83 | R209.2 86.17,69.73 v86.73,69.73 | C10.1 91.56,68.64 IC27.8 v90.63,69.26 v90.62,69.27 | R24.1 v87.53,40.96 | JTAG.1 89.47,19.6 v89.43,19.64 | R213.2 v87.7,76.6 | IC29.8 85.61,77.57 85.49,77.45 C65.1 v85.19,76.81 v85.2,76.8 | v76.94,97.1 76.92,97.11 R21.1 | R215.D2 v62.99,83.99 v63,84 | R35.A2 62.96,66.86 v62.9,66.8 | C70.1 74.88,75.22 v74.9,75.2 | C33.1 50.31,40.69 50,41 v54,41 | D1.A 55.76,97.94 v55.9,97.8 | D13.5 74.44,86.16 v74.5,86.1 | v77.2,77 77.22,76.98 RN1.A2 RN1.B2 RN1.C2 RN1.D2 80.45,77 v81.3,77 | R226.2 R227.2 v70.05,43.69 | C98.1 60.9,38.47 IC17.43 IC17.44 IC17.45 59.69,37.44 C97.1
  L1-HS 0.203: C31.1 +3V.TP 50.5,38.29 C33.1 48.27,38.1 L11.2 | C36.1 R23.1 v42.79,31.17 v42.78,31.18 | R215.D2 R215.C2 R215.B2 R215.A2 v62.99,79.5 62.99,78.63 R216.D2 R216.C2 R216.B2 R216.A2 R217.D2 R217.C2 R217.B2 R217.A2 R35.D2 R35.C2 R35.B2 R35.A2 | IC38.21 72.84,74.83 C69.1 73.89,75.03 C70.1 | 78.49,43.72 78,43.72 C9.1 77.97,43.69 v77.07,43.69 | 78.49,43.72 R212.2 78.72,43.03 v78.71,43.02 | IC28.2 78.49,44.82 78.49,43.72 | IC13.4 25.36,84.7 C55.1 v25.9,84.7 | R27.1 82.34,50.62 v82.34,49.77
  L1-HS 0.305: IC5.5 45.84,64.72 C76.1 46.68,65.1 | R13.1 46.68,65.1 | C18.1 55.6,65.05 | 55.6,65.05 R4.1 | 55.6,65.05 54.76,65.05 54.39,64.68 IC4.5 | 55.6,65.05 v56.2,65.05 | 46.68,65.1 v47.3,65.1 v47.31,65.11 | D3.A 37.69,97.26 54.08,97.26 D1.A | R8.2 v78.29,48.66
  L1-HS 0.508: v66.8,89.7 66.79,89.71 DISP.1 66.79,92.29 v67.05,92.55 67.29,92.79 DISP.2 v67.3,95
  L6-HS 0.2: v74.51,53.38 C56.1 75.21,54.03 C15.1 | C24.1 v70.92,53.35 v70.91,53.34 | C27.1 v70.52,58.07 | C57.1 v70.51,60.08 v70.5,60.07 | C14.1 v72.91,61.65 v72.92,61.66 | C25.1 76.91,61.62 v76.94,61.65 | v78.84,59.66 v78.83,59.67 C13.1 C20.1 | C19.1 v78.92,54.76 | C23.1 78.72,53.52 v78.72,53.36
  L6-HS 0.254: v42.78,31.18 42.78,31.75 44.01,32.98 44.01,36.82 45.19,38 v54,38
  other vias: 55,41 56,41 56,40 56,39 56,38 56,37 56,36 55,36 54,36 54,37 54,39 54,40 55,40 55,39 55,38 55,37
  pour L1-HS (isolate 0.203, rank 2, no thermals): 46.5,41.5 46.5,36.8 46.7,36.6 50.5,36.6 51.6,35.5 56.1,35.5 56.3,35.7 56.3,41.6 56.2,41.7 46.7,41.7
  pour L4-PWR (isolate 0.203, rank 6, no thermals): -4,104 98,104 98,79 98,-4 76,-4 -4,-4 -4,10
  pour L1-HS (isolate 0.203, no thermals): 59.36,38.71 61.76,38.71 61.85,38.62 61.85,37.31 61.78,37.24 59.55,37.24 59.37,37.42 59.36,37.43 59.36,38.69
+3V3_A  (via drill 0.2)
  L1-HS 0.149: v63.85,35.74 IC17.4 | v58.58,32.6 58.58,33.13 58.98,33.52 L5.2 59.4,33.13 v59.4,32.59
  L1-HS 0.203: C122.1 70.7,39.94 IC17.21 67.59,39.94 v67.56,39.97 | C125.1 67.36,33.28 IC17.11 v67.36,36.07 v67.37,36.08 | C126.1 65.86,33.09 IC17.8 v65.86,36.27 | IC17.4 63.86,33.09 C127.1 | C124.1 IC17.15 67.55,36.94 v67.53,36.92 | C123.1 70.75,37.94 IC17.17 v67.55,37.94 | R140.1 58.88,20.55 v58.86,20.53 | 3V3A1.TP 58.98,33.52
  L6-HS 0.149: R130.1 R129.1 62.98,32.29 63.85,33.16 v63.85,35.74
  pour L4-PWR (isolate 0.203, rank 2, no thermals): 58.36,34.47 61.21,34.47 64.77,38.03 64.77,41.48 71.06,42.45 71.06,42.45 71.32,42.71 72.86,42.71 73.32,42.25 73.32,34.73 70.83,32.24 70.83,29.53 68.54,27.24 68.54,20.78 67.62,19.86 58.68,19.86 58.3,20.24 58.3,34.41
+5V
  L1-HS 0.508: DISP.3 67.79,92.19 68.29,92.69 DISP.4
+5VA  (via drill 0.2, 0.35)
  L1-HS 0.203: C75.1 R39.1 v38.31,62.66 v38.3,62.67 | C72.1 44.17,52.55 +5VA.TP C73.1 44.18,57.18 L3.2
  L1-HS 0.305: IC1.1 C2.1 39.39,70.89 v39.5,71 | IC8.1 C17.1
  other vias: 40.5,71 38.5,71 38.5,72 39.5,72 40.5,72 48.5,71 49.5,71 49.5,72 48.5,72 47.5,72 47.5,71 45.5,72 45.5,71 46.5,71 48.5,61 49.5,61 50.5,61 51.5,61 52.5,61 52.5,60 51.5,60 50.5,60 49.5,60 48.5,60 48.5,59 49.5,59 50.5,59 51.5,59 52.5,59 46.5,55 46.5,53 48.5,53 48.5,55 50.5,55 50.5,53 52.5,53 52.5,55 52.5,57 50.5,57 48.5,57
  pour L1-HS (isolate 0.203, rank 2, no thermals): 38.5,72.5 50,72.5 50,71.5 50.5,71 50.5,66.5 50,66 38.5,66 38,66.5 38,72
  pour L6-HS (isolate 0.203, rank 2, no thermals): 38.5,72.5 50,72.5 50,71.5 50.5,71 50.5,66.5 50,66 38.5,66 38,66.5 38,72
  pour L1-HS (isolate 0.203, rank 2, no thermals): 42.6,59 42.6,56.2 41.3,54.9 41.3,51.3 41.5,51.1 52.9,51.1 53.3,51.5 53.3,61.4 52.9,61.8 47.9,61.8 47.8,61.7 47.8,59.6 47.5,59.3 42.9,59.3
  pour L1-HS (isolate 0.203, rank 2, no thermals): 43,53 43,59 36,59 36,75 54,75 53,74 53,51 44,51 43,52
  pour L6-HS (isolate 0.203, rank 2, no thermals): 43,53 43,59 36,59 36,75 54,75 53,74 53,51 44,51 43,52
+24V_A  (via drill 0.2, 0.35)
  L1-HS 0.2: R70.1 54.41,14.6 v54,15
  L1-HS 0.254: IC12.3 C80.1
  L1-HS 0.305: C50.1 21.33,27.5 v21.14,27.31
  L1-HS 0.406: C80.1 26.82,52.41 v26.82,51.61 | C256.1 38.73,18 v36,18
  L1-HS 0.61: D11.C 33.48,28.27 33.48,27.69 33.15,27.36 33.15,26.91 32.88,26.64 C48.1
  L1-HS 3: F3.2_1 F3.2_2
  L6-HS 0.406: v26.82,51.61 29.64,48.79 29.64,37.81 32.84,34.61 32.84,26.91 32.24,26.31 v28.14,26.31
  other vias: 20.14,27.31 19.14,27.31 16.14,26.31 16.14,25.31 17.14,25.31 18.14,25.31 19.14,25.31 20.14,25.31 21.14,25.31 22.14,25.31 23.14,25.31 23.14,26.31 23.14,27.31 22.14,27.31 22.14,26.31 21.14,26.31 20.14,26.31 19.14,26.31 18.14,26.31 17.14,26.31 18.14,27.31 17.14,27.31 16.14,27.31 19.14,28.31 19.14,29.31 24.14,27.31 25.14,27.31 26.14,27.31 24.14,28.31 25.14,28.31 26.14,28.31 27.14,28.31 27.14,27.31 24.14,25.31 25.14,25.31 26.14,25.31 27.14,25.31 28.14,25.31 29.14,25.31 30.14,25.31 31.14,25.31 32.14,25.31 33.14,25.31 33,18 33,21 33,24 30,24 27,24 27,21 27,18 36,15 42,15 36,21 39,21 42,21 45,21 48,21 51,21 48,18 45,18 42,18 45,15 48,15 54,21 54,18
  pour L1-HS (isolate 0.203, no thermals): 18.54,30.31 18.54,28.21 18.04,27.71 14.94,27.71 14.94,24.11 24,24 24,18 31.5,18 34.8,14.7 54.6,14.7 54.6,22 35.55,22 33.44,24.11 33.44,27.31 29.54,27.31 28.94,27.91 28.24,27.91 27.44,28.71 24.14,28.71 23.74,29.11 23.74,30.21 23.54,30.41 18.64,30.41
  pour L6-HS (isolate 0.203, no thermals): 18.54,30.31 18.54,28.21 18.04,27.71 14.94,27.71 14.94,24.11 24,24 24,18 31.5,18 34.8,14.7 54.6,14.7 54.6,22 35.55,22 33.44,24.11 33.44,27.31 29.54,27.31 28.94,27.91 28.24,27.91 27.44,28.71 24.14,28.71 23.74,29.11 23.74,30.21 23.54,30.41 18.64,30.41
+24V_B
  L1-HS 0.2: R72.1 29.3,14.51 F2.2_2
  L1-HS 3: F2.2_1 F2.2_2
+24V_C  (via drill 0.2, 0.35)
  L1-HS 0.2: R74.1 52.31,13.31 v51,12
  L1-HS 0.203: R44.1 39.89,62.06 v39.89,62.67 | IC2.2 C71.1 38.47,55.5 C74.1 v36,55.5 | IC40.2 49.6,32.88 C35.1 49.61,31.04 C34.1
  L1-HS 0.254: R37.1 42.74,34.03 v42.62,34.15
  L1-HS 0.406: C253.1 37.03,12 36.56,12 v33,12
  L1-HS 0.61: +24V.TP 22.92,3.83 23.11,4.02
  L1-HS 1.27: D9.C 23.11,4.02 25.09,6 v27,6
  L1-HS 3: F1.2_1 F1.2_2
  L4-PWR 0.254: v39.89,62.67 39.89,61.95 40.39,61.45 40.39,60.65 40.39,60.64 40.39,59.55 39.54,58.7 39.54,57.63 39,57.09 v39,55.5
  other vias: 33,9 33,6 36,6 36,9 36,12 39,12 39,9 42,9 42,12 45,12 45,9 48,9 51,9 48,12 39,6 42,6 45,6 48,6 51,6 30,6 24,6 36,56.5 36.5,57 37.5,57 36,54.5 39,54.5 49,29.5 50,29.5 51,29.5 52,29.5 48.5,30 48.5,31 50.5,32.5 51.5,32.5 51,31.5 51,30.5 37,54 38,54
  pour L1-HS (isolate 0.203, rank 2, no thermals): 24,11.2 31.9,11.2 34.9,14.2 52.9,14.2 53.3,13.8 53.3,7.6 50.7,5 35.2,5 34.7,4.5 24.6,4.5 23.7,5.4 23.7,10.9
  pour L4-PWR (isolate 0.203, rank 2, no thermals): 24.15,11.35 32.05,11.35 35.35,14.65 35.35,57.35 36,58 42,58 42,52 44,50 53.3,49.99 53.3,7.6 50.7,5 35.2,5 34.7,4.5 24.6,4.5 23.7,5.4 23.7,10.9
  pour L6-HS (isolate 0.203, rank 2, no thermals): 24,11.2 31.9,11.2 34.9,14.2 52.9,14.2 53.3,13.8 53.3,7.6 50.7,5 35.2,5 34.7,4.5 24.6,4.5 23.7,5.4 23.7,10.9
  pour L1-HS (isolate 0.203, rank 2, no thermals): 35.3,58.1 35.3,54.1 35.5,53.9 39,53.9 39.4,54.3 39.4,56.4 39.3,56.5 39.3,58.1
  pour L1-HS (isolate 0.203, rank 2, no thermals): 48.8,29.1 51.9,29.1 52.2,29.4 52.2,32.4 51.9,32.7 51.5,33.1 49.6,33.1 49.2,33.1 49.1,33 47.9,33 47.8,32.9 47.8,29.7 48.4,29.1
ADC_24VA  (via drill 0.2)
  L1-HS 0.2: R71.1 55.38,15.5 R70.2 | IC26.53 75.71,50.81 v75.6,50.7 | v56.1,50.4 56.03,50.33 56.03,48.57 56.74,47.86
  L1-HS 0.203: 55.38,15.5 55.86,15.5 56.03,15.67 56.03,17.62 56.74,18.33 56.74,47.86
  L6-HS 0.2: v75.6,50.7 56.4,50.7 v56.1,50.4
ADC_24VB  (via drill 0.2)
  L1-HS 0.2: R72.2 R73.1 | IC26.54 76.1,52.51 76.1,50.44 76,50.34 v76,50.2 | v56.5,49.8 56.5,48.9 57.21,48.19
  L1-HS 0.203: R73.1 32.95,14.11 33.09,13.96 34.26,13.96 34.71,14.41 53.88,14.41 54.35,13.94 55.74,13.94 56.41,14.61 56.41,17.46 57.21,18.26 57.21,48.19
  L6-HS 0.2: v76,50.2 56.9,50.2 v56.5,49.8
ADC_24VC  (via drill 0.2)
  L1-HS 0.2: R75.1 54.37,12.36 R74.2 | IC26.55 v76.51,49.61 v76.5,49.6 | v57.1,49.33 57.65,48.78 57.65,20.94 57.75,20.84
  L1-HS 0.203: 54.37,12.36 55.42,12.36 56.79,13.73 56.79,17.3 57.75,18.26 57.75,20.84
  L6-HS 0.2: v76.5,49.6 76.4,49.7 57.47,49.7 v57.1,49.33
ADC_AVDD  (via drill 0.2)
  L1-HS 0.2: R28.1 78.4,51.2 78.11,51.49 IC26.59 78.11,53.11 v77.93,53.29
  L1-HS 0.203: R29.2 80.15,50.43 80.03,50.55 79.2,50.55 79.19,50.54 79.07,50.66 R28.1
  L6-HS 0.2: C12.1 v77.92,53.3 v77.93,53.29
ADC_VUSB  (via drill 0.2)
  L1-HS 0.203: IC26.49 74.11,51.22 v74.16,51.17
  L1-HS 0.254: C29.1 84.05,9.69 R31.2
  L1-HS 0.305: ADVB.TP 84.37,13.39 v84.11,13.65
  L1-HS 0.508: R31.2 R32.1 83.3,11.13 ADVB.TP
  L3-SIG 0.203: v84.11,13.65 84.11,18.83 79.92,23.02 79.92,48.98 77.73,51.17 75.41,51.17 75.4,51.17 v74.16,51.17
AVDD
  L1-HS 0.203: IC28.1 77.46,44.85 AVDD.TP
  L1-HS 0.305: C8.1 77.25,45.9 77.46,45.68 77.46,44.85 | IC28.1 77.51,45.63 78.25,46.37 79.1,46.37 79.41,46.68 IC28.4 R8.1 79.41,49.05 79.07,49.39 R28.2
CC1
  L1-HS 0.149: USB9.A5 R19.1
CC1_PORT1  (via drill 0.2)
  L1-HS 0.203: PORT1.A5 21.09,95.46 v21.34,95.71 | v21.7,85.31 21.7,84.94 CC1.TP 22.28,84.25 21.76,83.73 21.76,83.33 22.15,82.94 23.91,82.94 24.92,81.93 IC9.2
  L6-HS 0.203: v21.7,85.31 21.7,87.85 20.84,88.71 20.84,95.21 v21.34,95.71
CC2
  L1-HS 0.149: USB9.B5 R18.1
CC2_PORT1  (via drill 0.2)
  L1-HS 0.203: PORT1.B5 20.09,95.46 v19.84,95.71 | v21.14,85.31 21.14,84.77 CC2.TP 21.25,83.74 21.25,83.17 21.94,82.48 23.72,82.48 24.14,82.06 24.42,81.78 IC9.3
  L6-HS 0.203: v21.14,85.31 21.14,87.61 20.34,88.41 20.34,95.21 v19.84,95.71
DISCHARGE1
  pour L1-HS (isolate 0.203, rank 2, no thermals): 19.94,72.71 19.94,69.61 20.04,69.51 25.34,69.51 25.44,69.61 25.44,71.01 25.34,71.11 24.04,71.11 23.94,71.21 23.94,72.51 23.74,72.71
EN_PORT1  (via drill 0.2)
  L1-HS 0.2: IC26.25 66.22,59.67 65.1,60.79 53.61,60.79 v53.51,60.69
  L1-HS 0.254: IC12.4 25.65,52.92 v25.88,53.15 26.06,53.33 R69.1
  L3-SIG 0.2: v53.51,60.69 53.51,61.51 53.09,61.93 42.57,61.93 41.23,63.27 36.14,63.27 34.91,62.04 34.91,56.98 31.01,53.08 28.34,53.08 28.11,52.85 26.18,52.85 v25.88,53.15
GND  (via drill 0.2, 0.35)
  L1-HS 0.149: C133.2 67.64,47.19 v67.67,47.16 66.35,47.16 X3.2 | C132.2 v62.62,49.17 v62.63,49.18 63.83,49.18 X3.4 | v65.87,41.67 v65.86,41.68 IC17.29 65.86,44.7 66.06,44.91 C121.2 v66.36,45.56 | IC26.62 v78.92,54.07 | C18.2 v56.19,64.11 v56.19,64.1
  L1-HS 0.2: v78.92,54.07 77.15,54.07 v77.06,53.98 | D12.2 v80.26,71.87 | IC39.PAD 87.75,72.15 86.5,70.91 IC39.4 v84.9,70.13 | IC27.PAD 87.78,66.28 86.33,64.83 IC27.4 84.93,63.92 v84.9,63.89 | C1.2 v92.14,74.14 | C10.2 92.14,69.54 91.69,69.98 v90.79,69.98 | v90.81,40.08 90.83,40.06 SW1.1 90.83,37.63 v90.87,37.59 | v90.9,33.62 90.9,32.42 SW2.2 90.82,31.06 v90.86,31.02 | JTAG.5 v89.48,22.14 | JTAG.3 89.48,20.87 v89.46,20.89 | JTAG.9 91.19,25.52 v91.22,25.55 | R75.2 54.34,11.3 v54.34,10.71 | R71.2 v55.39,17.01 | R73.2 v34.09,14.51 | R9.2 89.9,78.33 v89.9,78.8 | IC29.2 87.81,78.07 IC29.9 | IC29.3 87.81,78.57 87.72,78.48 | 87.72,78.48 IC29.9 | IC29.4 88.31,79.07 87.72,78.48 | IC29.7 87.31,78.07 IC29.9 | C65.2 v84.5,78 | DISP.Z2 v65.8,95 | DISP.Z0 64.55,94.56 v64.5,94.6 | DISP.Z0 64.44,92.5 v62.6,92.5 | DISP.Z0 64.55,90.14 v64.5,90.1 | DISP.Z1 65.79,89.91 v65.8,89.9 | v68.8,92.2 DISP.5 68.79,89.81 v68.8,89.8 | v70.3,92.7 70.29,92.71 DISP.8 v70.3,95 | DISP.Z5 78.5,92.44 v78.5,94.6 | DISP.Z5 78.45,90.15 v78.5,90.1 | DISP.Z5 v80.39,92.39 v80.4,92.4 | DISP.Z4 v77.3,95 | DISP.Z3 77.29,89.81 v77.3,89.8 | D2.C 52.49,97.95 v52.34,97.8 | D13.2 70.92,86.2 v70,86.2
  L1-HS 0.203: C43.2 v16.32,50.98 | C44.2 15.09,51.7 v15.06,51.67 | R68.2 15.09,52.41 v15.06,52.44 | R61.2 v16.25,53.15 | R58.2 16.27,53.89 v16.25,53.91 | C41.2 v16.59,49.91 | 16.07,58.31 C52.1 15.16,58.51 15.14,58.53 | v15.14,60.31 15.14,60.6 | 15.14,60.6 v15.14,61.31 | v15.14,62.31 15.14,62.68 | 15.14,62.68 v15.14,63.31 | v15.14,64.31 15.14,64.69 | 15.14,64.69 v15.14,65.31 | v15.14,59.31 15.14,58.53 | 15.14,58.53 v15.14,58.31 | C53.1 15.14,60.6 | C54.1 15.15,62.67 15.14,62.68 | C82.1 15.2,64.75 15.14,64.69 | C83.2 31.18,64.27 v31.14,64.31 | R49.2 v14.81,70.76 v14.82,70.75 | C39.2 14.75,76.15 | 14.75,76.15 v13.94,76.15 | 14.75,76.15 14.75,76.91 v14.73,76.93 | R51.2 v22.75,77.86 v22.74,77.86 | R51.2 v22.74,76.65 | R51.2 22.16,77.26 v22.14,77.24 | v22.21,79.47 v22.22,79.48 IC9.6 v24.06,79.48 | v25.74,71.81 25.7,71.77 R52.2 v24.74,72.51 | R40.2 36.77,62.6 v36.74,62.63 | C38.2 v39.12,62.62 v39.13,62.63 | R43.2 36.19,58.75 v36.17,58.77 | C85.2 36.76,57.97 v36.18,57.97 | v37.34,51.37 C74.2 39.62,52.66 C72.2 | C72.2 39.73,53.96 v39.7,53.99 | v40.07,54.78 41.28,54.78 C73.2 41.34,56.18 v41.36,56.2 | C71.2 39.66,55.58 v39.65,55.56 | IC2.4 40.55,57.16 v41.07,57.16 | C72.2 39.68,52.5 v39.68,51.26 | C35.2 49.63,33.47 v50.17,33.47 50.31,33.61 C33.2 50.28,35.29 v49,35.29 | IC40.4 48.43,34.87 v48.46,34.9 | C31.2 51.24,33.63 v51.22,33.61 | C31.2 52.64,33.57 v52.64,32.24 52.6,32.2 C34.2 | C34.2 v53.92,30.89 v53.93,30.88 | C34.2 52.63,30.86 v52.63,29.58 | C31.2 53.85,33.63 v53.88,33.66 | v47.01,29.93 47.01,30.48 C84.2 R36.2 47.78,29.93 v47.81,29.9 | R33.2 45.89,30.39 v45.91,30.37 | C32.2 v42.77,33.26 v42.76,33.25 | C96.2 v71.95,40.71 v71.96,40.7 | C122.2 71.33,39.98 v71.96,39.98
  L1-HS 0.203: C134.2 v73.05,39.13 v73.06,39.14 | C123.2 v71.93,37.96 v71.94,37.97 | C124.2 71.34,36.95 v71.94,36.95 | 66.34,32.52 C126.2 65.88,31.97 v65.86,31.95 | 66.34,32.52 R136.2 66.82,32.48 v66.82,31.95 | 66.34,32.52 66.36,32.53 IC17.9 v66.36,35.83 v66.37,35.84 | C125.2 v67.58,31.95 | C127.2 63.88,31.98 v63.86,31.96 | IC17.19 68.13,38.94 v68.11,38.96 | IC17.16 68.13,37.44 v68.1,37.41 | IC17.14 68.17,36.44 v68.09,36.36 | IC17.3 63.36,35.57 v63.19,35.74 | IC17.48 v62.11,35.94 v62.12,35.93 | C130.2 v58.84,19.41 v58.83,19.4 | IC38.9 69.96,75.33 70.1,75.19 | 70.1,75.19 IC38.25 | IC38.18 71.46,73.64 71.44,73.66 71.44,73.86 70.13,75.17 | 70.1,75.19 70.11,75.19 70.13,75.17 | IC38.22 70.5,75.33 | 70.5,75.33 70.29,75.33 70.13,75.17 | 70.5,75.33 71,75.83 IC38.23 72.16,75.82 73.05,75.82 | C69.2 73.05,75.82 | 73.05,75.82 v73.05,76.14 | C70.2 74.1,76.54 v74.1,77.34 | C63.2 64.14,60.15 v64.75,60.15 64.75,58.82 X1.4 | C62.2 v62.87,55.19 62.87,56.44 X1.2 | C9.2 77.44,43.16 v77.42,43.13 | IC13.3 24.73,85.58 C55.2 v24,84.7 | IC13.7 IC13.8 22.8,88.28 v22.8,88.3 | C22.2 v84.35,53.96 v84.36,53.95 | 24VGND.TP 5.24,39.41 v5.14,39.31
  L1-HS 0.254: R59.2 v27.74,54.81 | C42.2 v27.73,54.07 v27.74,54.06 | R69.2 27.21,53.35 v27.74,53.35 | C80.2 28.17,52.4 v28.83,52.4 | C66.2 75.25,10.19 v75.26,10.2 | C67.2 v74.1,8.55 v74.09,8.54 | C68.2 83.32,8.58 v84.06,8.58 | C29.2 v84.32,11.04 v84.33,11.05 | R18.2 v80.92,8.75 v80.91,8.76 | R19.2 77.91,8.77 v77.94,8.8 | R20.2 77.18,8.76 v77.14,8.8
  L1-HS 0.305: T9.2 T9.3 33.52,32.19 v33.54,32.21 | T9.2 T9.1 32.78,30.91 v33.54,30.91 | C47.2 v28.43,29.6 v28.44,29.61 | C49.2 v30.14,29.61 | C48.2 v32.25,29.6 v32.24,29.61 | T9.2 32.78,31.51 v33.54,31.51 | C50.2 13.39,29.26 v13.34,29.21 | C50.2 15.78,29.21 v17.94,29.21 | C50.2 v15.73,30.4 v15.74,30.41 | C50.2 v15.74,28.11 | C2.2 v39.39,69.24 | C17.2 v48.38,69.21 v48.39,69.2 | R3.2 R67.2 41.68,68 v41.65,68.03 | IC5.3 v43.66,66.03 | C76.2 v46.69,63.59 | R1.2 R56.2 v50.52,67.93 v50.51,67.94 | IC4.3 v52.49,66 v52.48,65.99 | C3.2 C4.2 49.38,74.13 48.44,75.07 C5.2 | C77.2 41.52,72.42 C78.2 40.56,74.03 39.47,75.12 C79.2 | C79.2 39.12,75.42 | C5.2 48.05,75.42 | C5.2 46.9,75.81 v46.29,76.42 | C79.2 37.94,75.77 v37.29,76.42 | D4.C 34.79,97.93 34.31,97.93 v33.99,97.61 | C8.2 v76.43,47.09 v76.42,47.1 | IC28.5 78.11,47.45 v78.17,47.51 | IC28.5 v76.89,47.45 | IC28.5 v77.51,48.34 v77.5,48.35 | C64.2 80.61,47.56 v80.58,47.59 | v82.13,47.41 82.88,47.41 REF1.3 82.97,47.42 v83.74,47.42 | v83.88,46.22 REF1.2 v83.88,43.98 C7.2
  L1-HS 0.406: IC1.2 v41.47,69.41 v41.48,69.4 | IC8.2 49.61,69.38 v50.52,69.38 | C215.2 v14.4,40.6 C216.2 | R50.1 v13.47,92.91 v13.46,92.91 | C40.1 27.82,92.61 v27.84,92.59 | PORT1.B12 23.29,95.16 v23.14,95.31 | PORT1.A12 17.89,95.06 v18.14,95.31
  L1-HS 0.508: USB9.GND 75.94,7.16 74.87,8.23 C67.2 | USB9.GND2 82.39,6.86 v83,7.46 83.3,7.76 C68.2 | v81.28,10.8 R32.2 v81.99,11.6 | C21.2 81.26,48.74 C26.2 80.41,48.71 v80.39,48.69 | ESD1.1 81.75,13.66 v81.77,13.68 | ESD1.1 v80.88,14.6 | ESD1.1 v80.87,12.77
  L1-HS 0.61: C11.2 35.22,82.52 v35.2,82.5 | R2.1 54.94,82.54 v54.9,82.5 | D11.A v40.39,32.63 | D11.A 40.36,30.75 v40.36,29.2 | D11.A 40.43,30.82 v42,30.82
  L1-HS 0.813: R10.2 C28.2 | R10.2 v87.99,15.52 v87.98,15.53 | C28.2 90.39,15.48 v90.42,15.51 | C28.2 90.48,14.05 v91.93,14.05 | R10.2 87.87,14.07 v86.61,14.07
  L1-HS 1.27: v14,4.04 14.02,4.02 D9.A 15.89,3.86
  L6-HS 0.149: C95.2 v65.72,29.54
  L6-HS 0.2: C19.2 v77.06,54.76 | C60.2 v77.08,55.49 v77.07,55.5 | C61.2 77.64,56.34 v77.08,56.34 | C23.2 77.67,53.98 v77.06,53.98 76.92,53.84 C12.2 | C56.2 v74.51,55.25 | C24.2 71.53,54.58 v71.54,54.59 | C58.2 72.23,56.87 v72.26,56.84 | C27.2 v72.25,58.06 | C57.2 v72.25,60.08 | C14.2 v72.91,59.9 | C59.2 v74.9,59.86 | C25.2 v76.91,59.7 77.61,59.7 C13.2 | C20.2 v76.92,58.95 v76.91,58.96 | C15.2 v75.22,55.25
  L6-HS 0.254: R141.1 v58.26,18.26 v58.25,18.27 | v72.15,18.25 v72.14,18.24 C131.2 69.7,16.74 ETH2.8
  other vias: 18.14,96.31 17.14,96.31 17.14,97.31 18.14,97.31 19.14,97.31 20.14,97.31 21.14,97.31 22.14,97.31 23.14,97.31 23.14,96.31 24.14,96.31 24.14,97.31 15.14,57.31 16.14,57.31 30.14,64.31 29.14,64.31 28.14,64.31 28.14,65.31 28.14,66.31 29.14,66.31 30.14,66.31 31.14,66.31 32.14,66.31 32.14,65.31 31.14,65.31 30.14,65.31 29.14,65.31 32.14,64.31 28.14,63.31 28.14,62.31 28.14,61.31 28.14,60.31 29.14,60.31 30.14,60.31 31.14,60.31 32.14,60.31 32.14,59.31 32.14,58.31 31.14,58.31 30.14,58.31 29.14,58.31 28.14,58.31 28.14,59.31 29.14,59.31 30.14,59.31 31.14,59.31 31.14,57.31 30.14,56.31 30.14,57.31 29.14,57.31 28.14,57.31 27.14,57.31 26.14,56.31 27.14,56.31 28.14,56.31 29.14,56.31 25.14,56.31 24.14,56.31 22.84,53.22 22.84,52.62 22.84,52.02 37.29,74.42 37.29,72.42 39.29,73.42 46.29,74.42 46.29,72.42 48.29,73.42 39.29,88.42 40.29,88.42 39.29,89.42 41.79,91.42 40.29,89.42 41.79,90.42 39.14,3.31 41.14,3.31 43.14,3.31 45.14,3.31 35.14,3.31 33.14,3.31 30.14,3.31 51.14,3.31 53.14,3.31 53.14,5.31 28.14,3.31 26.14,3.31 24.14,3.31 37.14,24.31 37.14,26.31 37.14,28.31 35.14,28.31 35.14,26.31 35.14,24.31 41.14,24.31 43.14,24.31 45.14,24.31 47.14,24.31 49.14,24.31 49.14,26.31 41.14,26.31 43.14,26.31 45.14,26.31 47.14,26.31 47.14,28.31 45.14,28.31 43.14,28.31 41.14,28.31 49.14,28.31 53.14,24.31 53.14,26.31 53.14,28.31 55.14,28.31 55.14,26.31 55.14,24.31 5.14,36.31 5.14,34.31 5.14,31.31 5.14,29.31 5.14,26.31 3.14,26.31 3.14,34.31 3.14,31.31 3.14,29.31 8.14,26.31 8.14,29.31 8.14,31.31 8.14,34.31 10.14,34.31 12.14,34.31 12.14,31.31 10.14,31.31 10.14,29.31 12.14,29.31 12.14,26.31 10.14,26.31 3.14,36.31 3.14,39.31 8.14,39.31 10.14,39.31 12.14,39.31 8.14,36.31 10.14,36.31 12.14,36.31 87.75,72.81 87.78,66.74 74.71,57.47 73.71,57.47 73.71,58.47 74.71,58.47 75.71,58.47 75.71,57.47 75.71,56.47 74.71,56.47 73.71,56.47 86.78,66.74 86.78,68.24 87.78,68.24 88.78,68.24 88.78,66.74 88.78,65.24 87.78,65.24 86.78,65.24 86.75,72.81 86.75,74.31 87.75,74.31 88.75,74.31 88.75,72.81 88.75,71.31 87.75,71.31 86.75,71.31 70.21,75.08 69.51,75.78 69.51,74.38 70.91,74.38 70.91,75.78 78.68,14.64 65,2.93 66,2.93 64.5,4.93 67,4.93
  pour L1-HS (isolate 0.203, rank 2, no thermals): 22.34,51.71 22.34,53.81 21.94,54.21 21.94,56.71 22.64,57.41 25.94,57.41 26.94,58.41 26.94,67.11 33.34,67.11 33.34,57.31 31.54,55.51 23.24,55.51 22.74,55.01 22.74,53.61 23.34,53.01 23.34,51.71
  pour L1-HS (isolate 0.203, rank 2, no thermals): 16.84,65.61 14.64,65.61 14.44,65.41 14.44,57.01 15.24,56.21 16.54,56.21 17.04,56.71 17.04,65.41
  pour L6-HS (isolate 0.203, rank 2, no thermals): 16.84,65.61 14.64,65.61 14.44,65.41 14.44,57.01 15.24,56.21 16.54,56.21 17.04,56.71 17.04,65.41
  pour L6-HS (isolate 0.203, rank 2, no thermals): 22.34,51.71 22.34,53.81 21.94,54.21 21.94,56.71 22.64,57.41 25.94,57.41 26.94,58.41 26.94,67.11 33.34,67.11 33.34,57.31 31.54,55.51 23.24,55.51 22.74,55.01 22.74,53.61 23.34,53.01 23.34,51.71
  pour L2-GND (isolate 0.203, rank 6, no thermals): 0,102 96,102 96,59 96,-2 88,-2 -2,-2 -2,31 -2,102
  pour L5-GND (isolate 0.203, rank 6, no thermals): -2,105 99,105 99,94 99,-5 93,-5 -5,-5 -5,2 -5,105
  pour L1-HS (isolate 0.203, rank 6, no thermals): -1,101 95,101 95,0 95,-1 27,-1 -1,-1 -1,18
  pour L3-SIG (isolate 0.203, rank 6, no thermals): -3,103 97,103 97,82 97,-3 59,-3 -3,-3 -3,24
  pour L6-HS (isolate 0.203, rank 6, no thermals): -6,106 100,106 100,61 100,-6 95,-6 -6,-6 -6,7
I2C0_SCL  (via drill 0.2)
  L1-HS 0.2: IC26.2 78.11,72.45 78.48,72.82 D12.3 v80.23,72.82 | RN1.B1 78.83,74.3 v78.81,74.28
  L1-HS 0.203: IC38.19 73.35,73.83 v73.48,73.7
  L3-SIG 0.2: v78.81,74.28 78.81,73.3 79.29,72.82 v80.23,72.82
  L3-SIG 0.203: v73.48,73.7 75.31,73.7 76.98,75.37 78.29,75.37 78.81,74.85 v78.81,74.28
I2C0_SDA  (via drill 0.2)
  L1-HS 0.2: IC26.1 78.51,70.55 78.7,70.74 79.03,70.74 D12.1 v80.26,70.91 | RN1.D1 v80.43,74.32
  L1-HS 0.203: IC38.20 v73.47,74.33 v73.48,74.34
  L3-SIG 0.203: v73.48,74.34 75.34,74.34 76.76,75.76 79.74,75.76 80.43,75.07 v80.43,74.32
  L6-HS 0.2: v80.26,70.91 79.05,70.91 78.67,71.29 78.67,72.18 80.43,73.94 v80.43,74.32
I2C1_SCL  (via drill 0.2)
  L1-HS 0.2: IC26.4 77.31,70.57 76.96,70.92 D12.6 v75.59,70.92 v75.58,70.91 | RN1.C1 v79.63,74.34 v79.64,74.33 | IC29.6 83.87,78.57 v83.7,78.4 | DISP.7 69.79,89.77 v69.86,89.7
  L3-SIG 0.2: v69.86,89.7 69.86,89.24 70.9,88.2 78,88.2 79.2,87 79.2,80 80.8,78.4 v83.7,78.4
  L6-HS 0.2: v75.58,70.91 77.19,70.91 77.66,71.38 77.66,71.91 79.64,73.89 v79.64,74.33 79.64,77.84 80.2,78.4 v83.7,78.4
I2C1_SDA  (via drill 0.2)
  L1-HS 0.2: IC26.3 77.71,72.44 77.33,72.82 D12.4 v75.53,72.82 | RN1.A1 v78.03,74.28 v78.04,74.27 | IC29.5 83.63,79.07 v83.6,79.1 | DISP.6 69.29,92.51 v69.4,92.4
  L3-SIG 0.2: v78.04,74.27 78.04,73.42 77.44,72.82 v75.53,72.82 | v69.4,92.4 70.4,91.4 70.4,89.4 71.2,88.6 78.3,88.6 79.7,87.2 79.7,80.2 80.8,79.1 v83.6,79.1
  L6-HS 0.2: v83.6,79.1 79.5,79.1 78.04,77.64 v78.04,74.27
IN1_PORT1  (via drill 0.2, 0.35)
  L1-HS 0.203: R57.2 17.39,84.33 | 17.39,84.33 15.16,84.33 v15.14,84.31 | IC13.1 23.52,85.7 23.52,86.39 23.17,86.75 17.82,86.75 17.39,86.32 17.39,84.33 | IC9.12 25.42,76.93 v25.94,76.41
  L6-HS 0.305: v25.94,76.41 25.94,77.94 26.2,78.2 26.2,80.1 24,82.3 18.3,82.3 18.3,81.47 v18.14,81.31
  other vias: 15.14,83.31 15.07,81.34 16.14,81.31 17.14,81.31 18.14,83.31 16.14,83.31 17.14,83.31 16.14,84.31 17.14,84.31 18.14,84.31
  pour L1-HS (isolate 0.203, no thermals): 19.44,80.11 19.44,85.21 14.24,85.21 14.24,80.11
  pour L6-HS (isolate 0.203, no thermals): 19.44,80.11 19.44,85.21 14.24,85.21 14.24,80.11
  pour L4-PWR (isolate 0.203, no thermals): 19.44,80.11 19.44,85.21 14.24,85.21 14.24,80.11
IN2_PORT1  (via drill 0.35)